# EAGLE design PoE_RFID_rev-D (EAGLE 8.7.0)

## Sheet 1 of 2
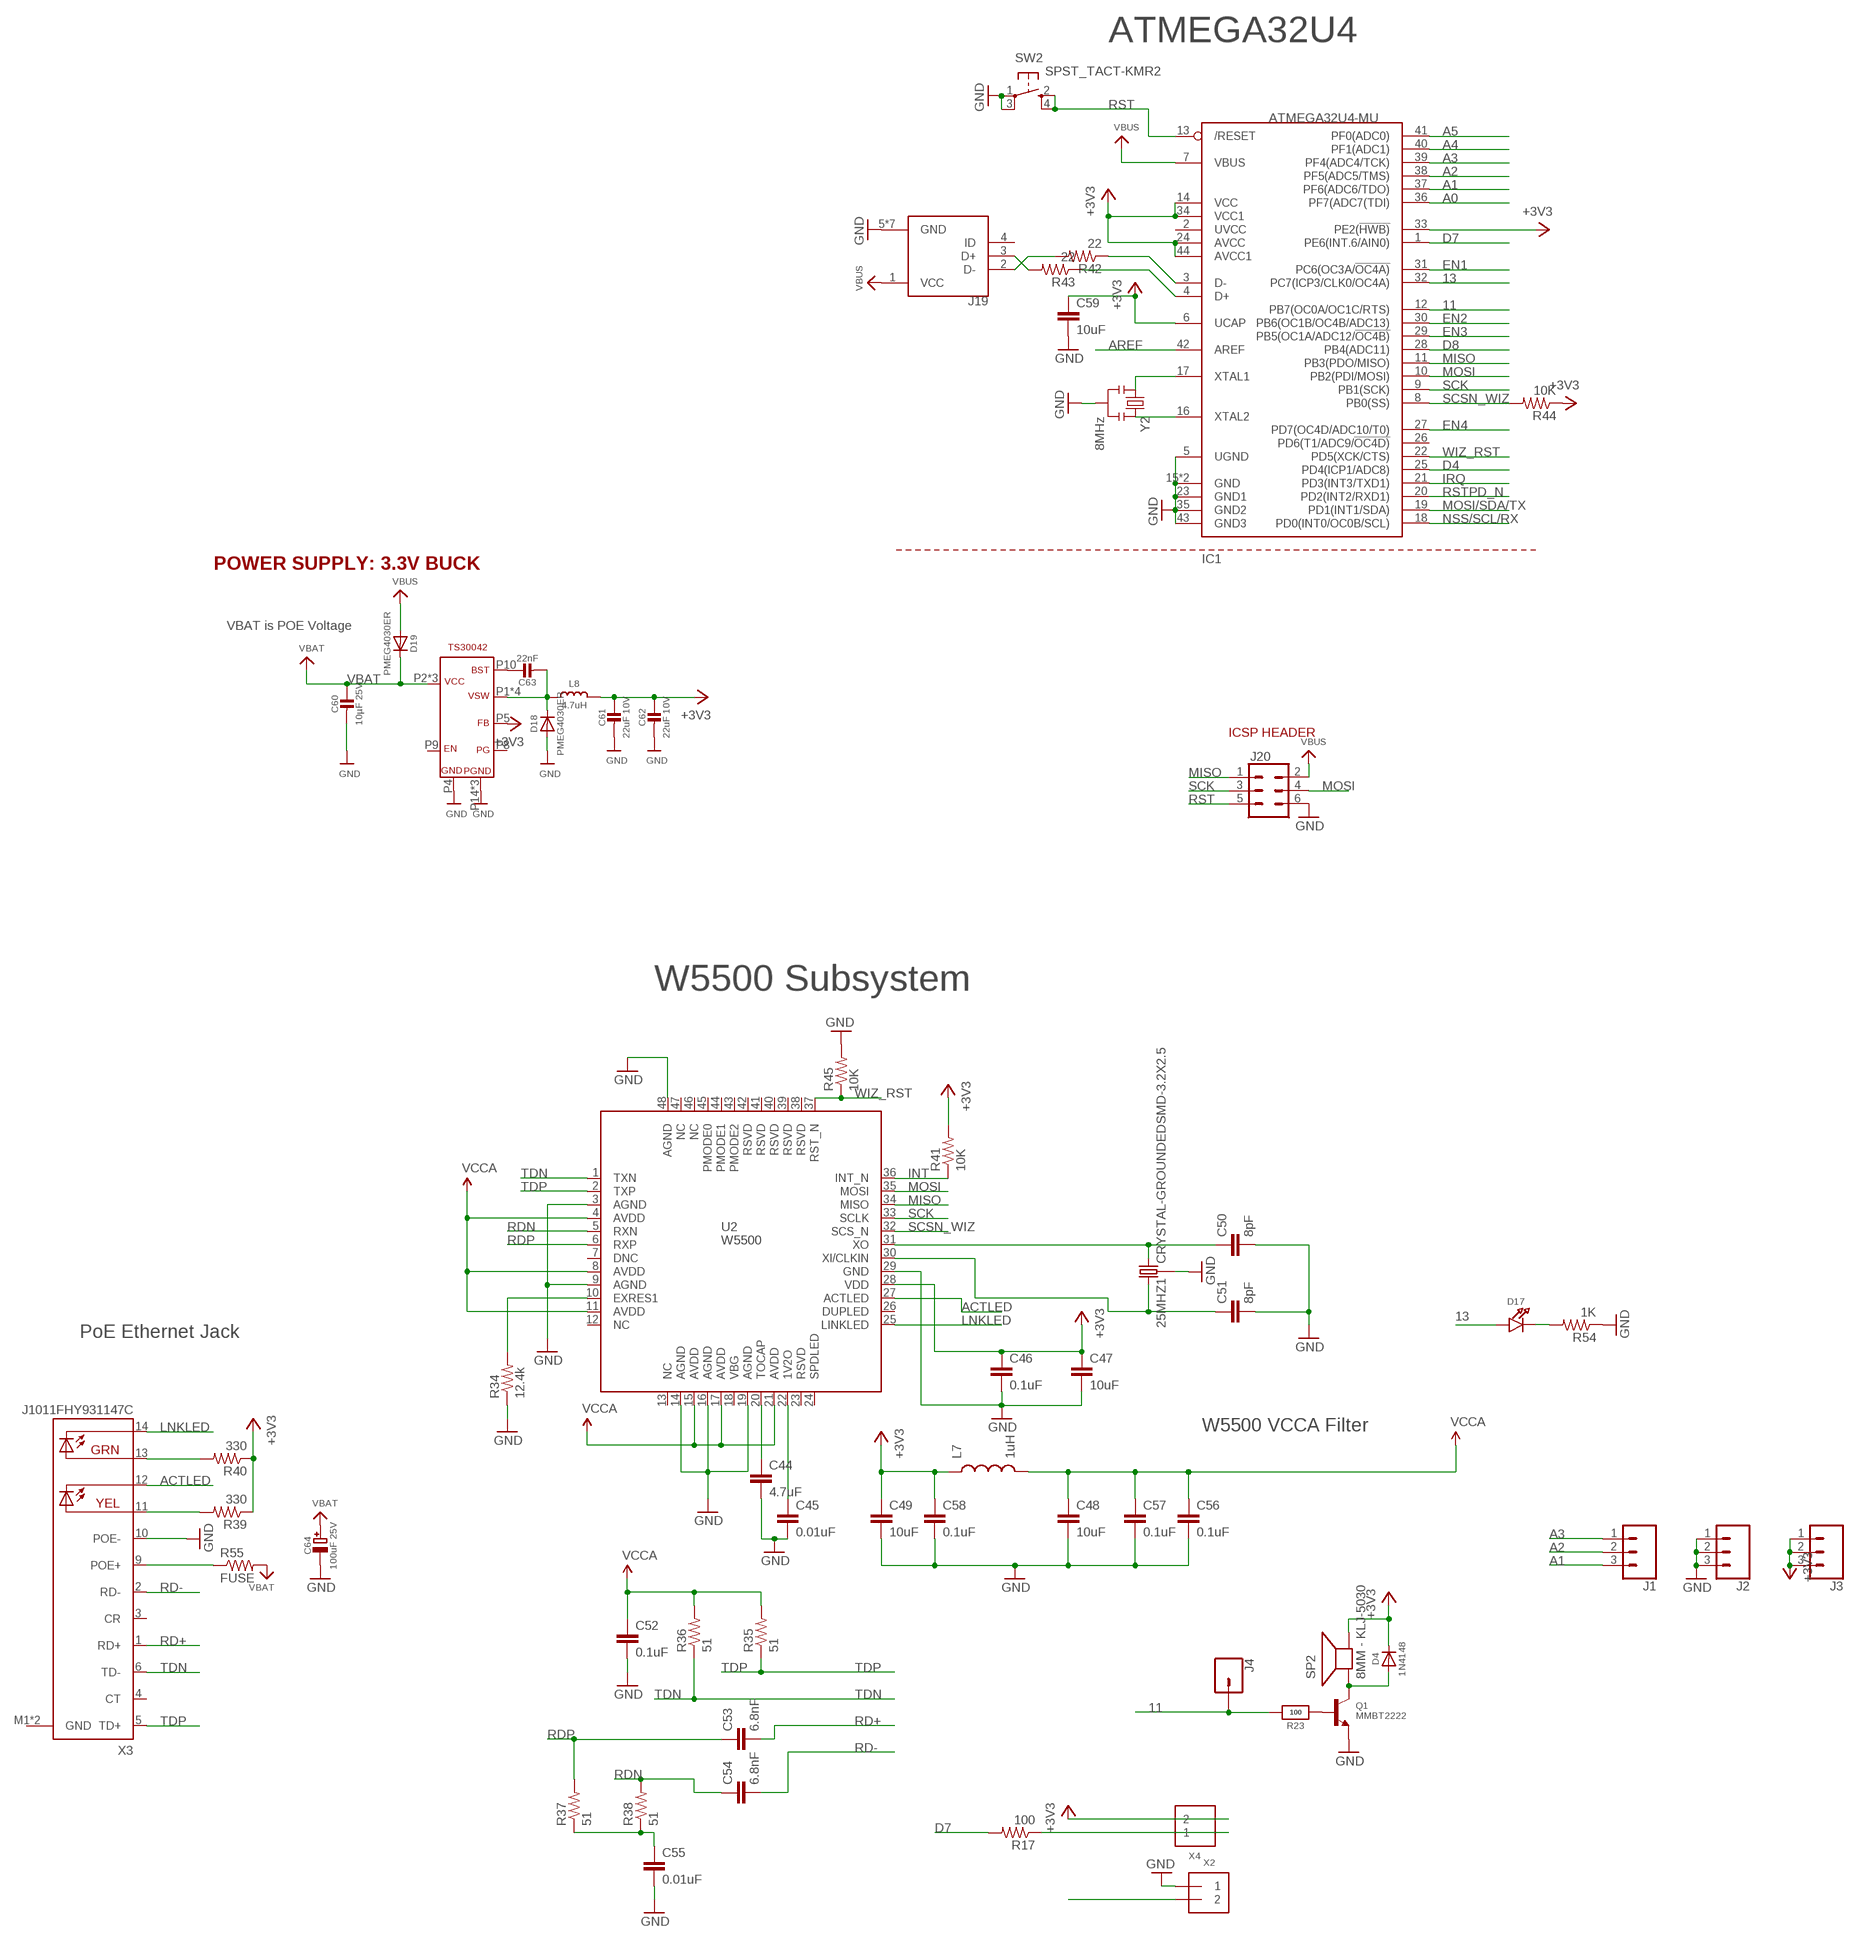
[diagram p0: schematic, sheet 1]

### Parts
25MHZ1  CRYSTAL-GROUNDEDSMD-3.2X2.5  [CRYSTAL-SMD-3.2X2.5MM]
C44  4.7uF  CAP0603-CAP  [0603-CAP]
C45  0.01uF  CAP0603-CAP  [0603-CAP]
C46  0.1uF  CAP0603-CAP  [0603-CAP]
C47  10uF  CAP0603-CAP  [0603-CAP]
C48  10uF  CAP0603-CAP  [0603-CAP]
C49  10uF  CAP0603-CAP  [0603-CAP]
C50  8pF  CAP0603-CAP  [0603-CAP]
C51  8pF  CAP0603-CAP  [0603-CAP]
C52  0.1uF  CAP0603-CAP  [0603-CAP]
C53  6.8nF  CAP0603-CAP  [0603-CAP]
C54  6.8nF  CAP0603-CAP  [0603-CAP]
C55  0.01uF  CAP0603-CAP  [0603-CAP]
C56  0.1uF  CAP0603-CAP  [0603-CAP]
C57  0.1uF  CAP0603-CAP  [0603-CAP]
C58  0.1uF  CAP0603-CAP  [0603-CAP]
C59  10uF  CAP0603-CAP  [0603-CAP]
C60  10µF 25V  CAP_CERAMIC0603MINI  [0603-MINI]
C61  22uF 10V  CAP_CERAMIC0603MINI  [0603-MINI]
C62  22uF 10V  CAP_CERAMIC0603MINI  [0603-MINI]
C63  22nF  CAP_CERAMIC0603MINI  [0603-MINI]
C64  100uF 25V  CAP_ELECTROLYTICPANASONIC_D  [PANASONIC_D]
D4  1N4148  DIODESOD-323  [SOD-323]
D17  LED0805_NOOUTLINE  [CHIPLED_0805_NOOUTLINE]
D18  PMEG4030ER  DIODESOD-123  [SOD-123]
D19  PMEG4030ER  DIODESOD-123  [SOD-123]
IC1  ATMEGA32U4-MU  [TQFN44_7MM]
J1  CONN_031X03_NO_SILK  [1X03_NO_SILK]
J2  CONN_03  [1X03]
J3  CONN_03  [1X03]
J4  CONN_01  [1X01]
J19  10103594-0001LF  [FCI_10103594-0001LF]
J20  CONN_03X2NO_SILK  [2X3-NS]
L7  1uH  INDUCTOR0603  [0603]
L8  4.7uH  INDUCTORTDK_VLC5045  [INDUCTOR_5X5MM_TDK_VLC5045]
Q1  MMBT2222  TRANSISTOR_NPNWIDE  [SOT23-WIDE]
R17  100  RESISTOR0603-RES  [0603-RES]
R23  100  RESISTOR_0603_NOOUT  [0603-NO@1]
R34  12.4k  RESISTOR0603-RES  [0603-RES]
R35  51  RESISTOR0603-RES  [0603-RES]
R36  51  RESISTOR0603-RES  [0603-RES]
R37  51  RESISTOR0603-RES  [0603-RES]
R38  51  RESISTOR0603-RES  [0603-RES]
R39  330  RESISTOR0603-RES  [0603-RES]
R40  330  RESISTOR0603-RES  [0603-RES]
R41  10K  RESISTOR0603-RES  [0603-RES]
R42  22  RESISTOR0603-RES  [0603-RES]
R43  22  RESISTOR0603-RES  [0603-RES]
R44  10K  RESISTOR0603-RES  [0603-RES]
R45  10K  RESISTOR0603-RES  [0603-RES]
R54  1K  RESISTOR0603-RES  [0603-RES]
R55  FUSE  RESISTOR0603-RES  [0603-RES]
SP2  8MM - KLJ-5030  SPEAKER_BUZZER5MM  [BUZZER_SMT_5MM]
SW2  SPST_TACT-KMR2  [KMR2]
U2  W5500  [W5500]
U$55  BUCK_CONVERTER  [QFN-16]
X2  TERMBLOCK_1X2  [TERMBLOCK_1X2-3.5MM]
X3  J1011FHY931147C  [HANRUN_POE]
X4  TERMBLOCK_1X2  [TERMBLOCK_1X2-3.5MM]
Y2  8MHz  RESONATORSMD  [RESONATOR-SMD]

### Nets
11: IC1.12(PB7(OC0A/OC1C/RTS)) J4.1 R23.2
13: D17.A IC1.32(PC7(ICP3/CLK0/OC4A))
+3V3: C46.1 C47.1 C49.1 C58.1 C59.1 C61.1 C62.1 D4.C IC1.6(UCAP) IC1.14(VCC) IC1.24(AVCC) IC1.33(PE2(!HWB)) IC1.34(VCC1) IC1.44(AVCC1) J3.1 J3.2 J3.3 L7.1 L8.P$2 R39.1 R40.1 R41.2 R44.1 SP2.- U2.28(VDD) U$55.P5(FB) X2.2 ; also sheet 2
A0: IC1.36(PF7(ADC7(TDI))
A1: IC1.37(PF6(ADC6/TDO)) J1.3
A2: IC1.38(PF5(ADC5/TMS)) J1.2
A3: IC1.39(PF4(ADC4/TCK)) J1.1
A4: IC1.40(PF1(ADC1))
A5: IC1.41(PF0(ADC0))
ACTLED: U2.27(ACTLED) X3.12(YEL-C)
AREF: IC1.42(AREF)
D4: IC1.25(PD4(ICP1/ADC8))
D7: IC1.1(PE6(INT.6/AIN0)) R17.2
D8: IC1.28(PB4(ADC11))
D+1: IC1.4(D+) R43.1
D-1: IC1.3(D-) R42.1
EN1: IC1.31(PC6(OC3A/!OC4A)) X4.2
EN2: IC1.30(PB6(OC1B/OC4B/ADC13))
EN3: IC1.29(PB5(OC1A/ADC12/!OC4B))
EN4: IC1.27(PD7(OC4D/ADC10/T0))
GND: 25MHZ1.2 25MHZ1.4 C44.2 C45.2 C46.2 C47.2 C48.2 C49.2 C50.2 C51.2 C52.2 C55.2 C56.2 C57.2 C58.2 C59.2 C60.2 C61.2 C62.2 C64.- D18.A IC1.5(UGND) IC1.15(GND) IC1.23(GND1) IC1.35(GND2) IC1.43(GND3) IC1.THERMAL(GND) J2.1 J2.2 J2.3 J19.5(GND) J19.P1(GND) J19.P2(GND) J19.P3(GND) J19.P4(GND) J19.P5(GND) J19.P6(GND) J20.6 Q1.2(E) R34.1 R45.2 R54.1 SW2.1(P) SW2.3(P1) U2.3(AGND) U2.9(AGND) U2.14(AGND) U2.16(AGND) U2.19(AGND) U2.29(GND) U2.48(AGND) U$55.P4(GND) U$55.P14(PGND) U$55.P15(PGND) U$55.PAD(PGND) X3.10(POE-) X4.1 Y2.2 ; also sheet 2
INT: R41.1 U2.36(INT_N)
IRQ: IC1.21(PD3(INT3/TXD1)) ; also sheet 2
LNKLED: U2.25(LINKLED) X3.14(GRN-C)
MISO: IC1.11(PB3(PDO/MISO)) J20.1 U2.34(MISO)
MOSI: IC1.10(PB2(PDI/MOSI)) J20.4 U2.35(MOSI)
MOSI/SDA/TX: IC1.19(PD1(INT1/SDA)) ; also sheet 2
N$15: R17.1 X2.1
N$29: Q1.1(B) R23.1
N$30: D4.A Q1.3(C) SP2.+
N$37: C44.1 U2.20(TOCAP)
N$38: C45.1 U2.22(1V2O)
N$39: R34.2 U2.10(EXRES1)
N$40: C55.1 R37.1 R38.1
N$41: 25MHZ1.3 C50.1 U2.31(XO)
N$42: 25MHZ1.1 C51.1 U2.30(XI/CLKIN)
N$43: IC1.16(XTAL2) Y2.3
N$44: IC1.17(XTAL1) Y2.1
N$45: J19.3(D+) R43.2
N$46: J19.2(D-) R42.2
N$51: D17.C R54.2
N$52: R40.2 X3.13(GRN-A)
N$53: R39.2 X3.11(YEL-A)
N$54: C63.1 U$55.P10(BST)
N$56: C63.2 D18.C L8.P$1 U$55.P1(VSW) U$55.P12(VSW) U$55.P13(VSW) U$55.P16(VSW)
N$57: R55.1 X3.9(POE+)
NSS/SCL/RX: IC1.18(PD0(INT0/OC0B/SCL)) ; also sheet 2
RD+: C53.2 X3.1(RD+)
RD-: C54.2 X3.2(RD-)
RDN: C54.1 R38.2 U2.5(RXN)
RDP: C53.1 R37.2 U2.6(RXP)
RST: IC1.13(/RESET) J20.5 SW2.2(S) SW2.4(S1)
RSTPD_N: IC1.20(PD2(INT2/RXD1)) ; also sheet 2
SCK: IC1.9(PB1(SCK)) J20.3 U2.33(SCLK)
SCSN_WIZ: IC1.8(PB0(SS)) R44.2 U2.32(SCS_N)
TDN: R36.1 U2.1(TXN) X3.6(TD-)
TDP: R35.1 U2.2(TXP) X3.5(TD+)
VBAT: C60.1 C64.+ D19.C R55.2 U$55.P2(VCC) U$55.P3(VCC) U$55.P11(VCC)
VBUS: D19.A IC1.7(VBUS) J19.1(VCC) J20.2
VCCA: C48.1 C52.1 C56.1 C57.1 L7.2 R35.2 R36.2 U2.4(AVDD) U2.8(AVDD) U2.11(AVDD) U2.15(AVDD) U2.17(AVDD) U2.21(AVDD)
WIZ_RST: IC1.22(PD5(XCK/CTS)) R45.1 U2.37(RST_N)
Unconnected: IC1.2(UVCC) IC1.26(PD6(T1/ADC9/!OC4D)) J19.4(ID) U2.7(DNC) U2.12(NC) U2.13(NC) U2.18(VBG) U2.23(RSVD) U2.24(SPDLED) U2.26(DUPLED) U2.38(RSVD) U2.39(RSVD) U2.40(RSVD) U2.41(RSVD) U2.42(RSVD) U2.43(PMODE2) U2.44(PMODE1) U2.45(PMODE0) U2.46(NC) U2.47(NC) U$55.P8(PG) U$55.P9(EN) X3.3(CR) X3.4(CT)

### Notes on the sheet
- ATMEGA32U4
- POWER SUPPLY: 3.3V BUCK
- VBAT is POE Voltage
- ICSP HEADER
- W5500 Subsystem
- PoE Ethernet Jack
- W5500 VCCA Filter

## Sheet 2 of 2
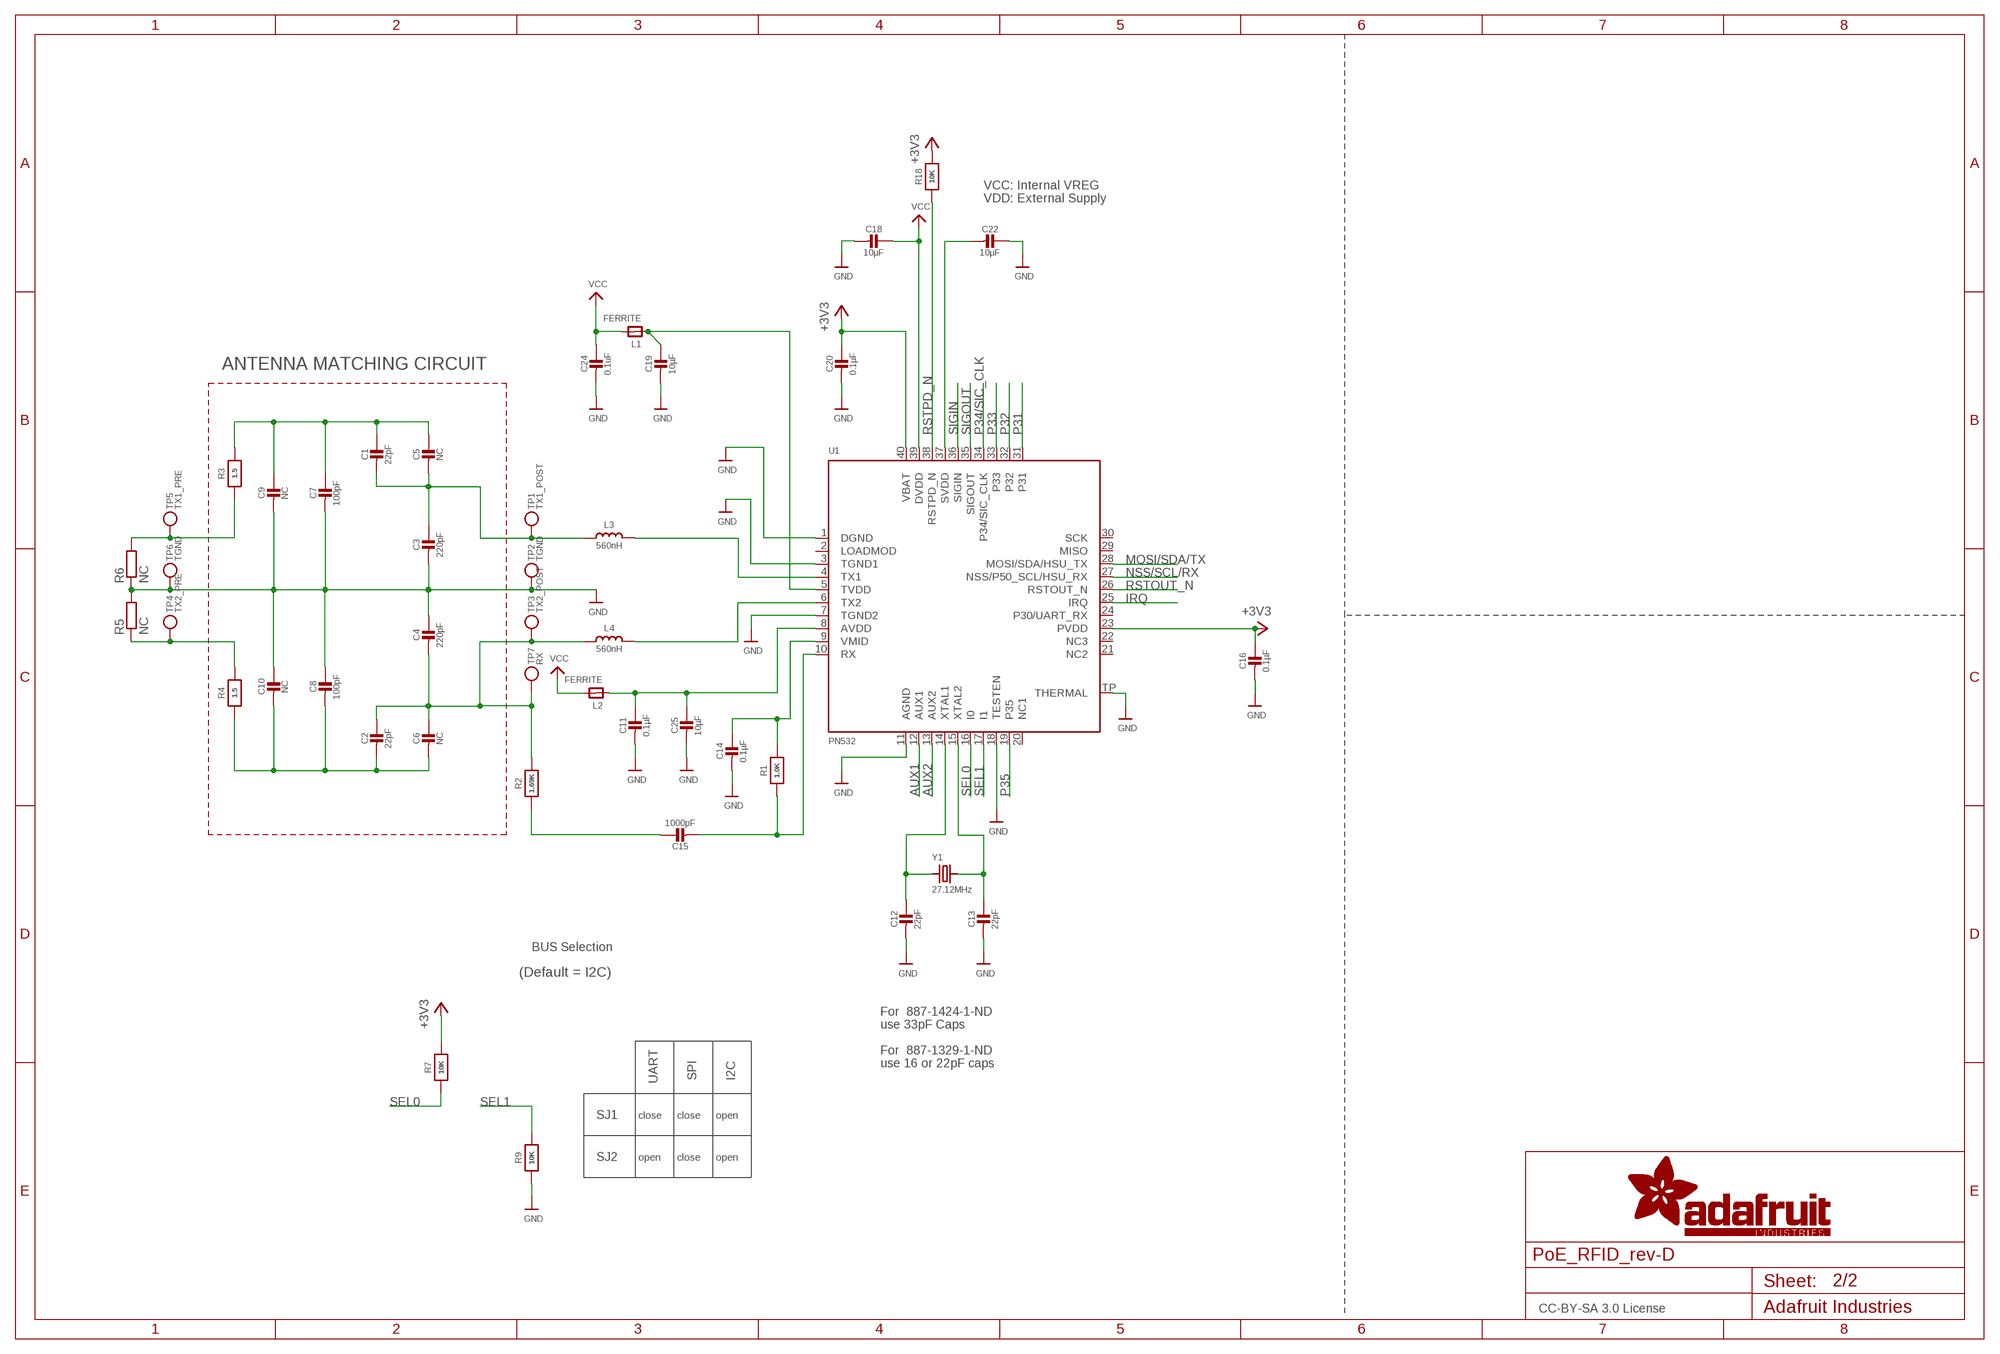
[diagram p1: schematic, sheet 2]

### Parts
C1  22pF  CAP_CERAMIC0603_NO  [0603-NO]
C2  22pF  CAP_CERAMIC0603_NO  [0603-NO]
C3  220pF  CAP_CERAMIC0603_NO  [0603-NO]
C4  220pF  CAP_CERAMIC0603_NO  [0603-NO]
C5  NC  CAP_CERAMIC0603_NO  [0603-NO]
C6  NC  CAP_CERAMIC0603_NO  [0603-NO]
C7  100pF  CAP_CERAMIC0603_NO  [0603-NO]
C8  100pF  CAP_CERAMIC0603_NO  [0603-NO]
C9  NC  CAP_CERAMIC0603_NO  [0603-NO]
C10  NC  CAP_CERAMIC0603_NO  [0603-NO]
C11  0.1µF  CAP_CERAMIC0603_NO  [0603-NO]
C12  22pF  CAP_CERAMIC0603_NO  [0603-NO]
C13  22pF  CAP_CERAMIC0603_NO  [0603-NO]
C14  0.1µF  CAP_CERAMIC0603_NO  [0603-NO]
C15  1000pF  CAP_CERAMIC0603_NO  [0603-NO]
C16  0.1µF  CAP_CERAMIC0603_NO  [0603-NO]
C18  10µF  CAP_CERAMIC0603_NO  [0603-NO]
C19  10µF  CAP_CERAMIC0603_NO  [0603-NO]
C20  0.1µF  CAP_CERAMIC0603_NO  [0603-NO]
C22  10µF  CAP_CERAMIC0603_NO  [0603-NO]
C24  0.1uF  CAP_CERAMIC0603_NO  [0603-NO]
C25  10µF  CAP_CERAMIC0603_NO  [0603-NO]
L1  FERRITE  FERRITE_0603  [_0603]
L2  FERRITE  FERRITE_0603  [_0603]
L3  560nH  INDUCTOR0603_NO  [0603-NO]
L4  560nH  INDUCTOR0603_NO  [0603-NO]
R1  1.0K  RESISTOR_0603_NOOUT  [0603-NO@1]
R2  1.69K  RESISTOR_0603_NOOUT  [0603-NO@1]
R3  1.5  RESISTOR_0603_NOOUT  [0603-NO@1]
R4  1.5  RESISTOR_0603_NOOUT  [0603-NO@1]
R5  NC  R-EU_R0201  [R0201]
R6  NC  R-EU_R0201  [R0201]
R7  10K  RESISTOR_0603_NOOUT  [0603-NO@1]
R9  10K  RESISTOR_0603_NOOUT  [0603-NO@1]
R18  10K  RESISTOR_0603_NOOUT  [0603-NO@1]
TP1  TX1_POST  TESTPOINT1.5X2.0MM_NOCREAM  [PAD-1.5X2.0]
TP2  TGND  TESTPOINT1.5X2.0MM_NOCREAM  [PAD-1.5X2.0]
TP3  TX2_POST  TESTPOINT1.5X2.0MM_NOCREAM  [PAD-1.5X2.0]
TP4  TX2_PRE  TESTPOINT1.5X2.0MM_NOCREAM  [PAD-1.5X2.0]
TP5  TX1_PRE  TESTPOINT1.5X2.0MM_NOCREAM  [PAD-1.5X2.0]
TP6  TGND  TESTPOINT1.5X2.0MM_NOCREAM  [PAD-1.5X2.0]
TP7  RX  TESTPOINT1.5X2.0MM_NOCREAM  [PAD-1.5X2.0]
U1  PN532  [HVQFN40-6X6]
Y1  27.12MHz  CRYSTAL3.2X2.5  [CRYSTAL_3.2X2.5]

### Nets
+3V3: C16.1 C20.1 R7.2 R18.2 U1.23(PVDD) U1.40(VBAT) ; also sheet 1
AUX1: U1.12(AUX1)
AUX2: U1.13(AUX2)
GND: C3.2 C4.1 C7.2 C8.1 C9.2 C10.1 C11.2 C12.2 C13.2 C14.2 C16.2 C18.2 C19.2 C20.2 C22.1 C24.2 C25.2 R5.2 R6.1 R9.1 TP2.P$1 TP6.P$1 U1.1(DGND) U1.3(TGND1) U1.7(TGND2) U1.11(AGND) U1.18(TESTEN) U1.TP(THERMAL) ; also sheet 1
IRQ: U1.25(IRQ) ; also sheet 1
MOSI/SDA/TX: U1.28(MOSI/SDA/HSU_TX) ; also sheet 1
N$1: L3.2 U1.4(TX1)
N$2: L4.2 U1.6(TX2)
N$3: C1.2 C3.1 C5.2 L3.1 TP1.P$1
N$4: R3.1 R6.2 TP5.P$1
N$5: R4.2 R5.1 TP4.P$1
N$7: C12.1 U1.14(XTAL1) Y1.1
N$8: C13.1 U1.15(XTAL2) Y1.2
N$9: C15.1 R2.1
N$10: C14.1 R1.2 U1.9(VMID)
N$11: C15.2 R1.1 U1.10(RX)
N$12: C2.1 C4.2 C6.1 L4.1 R2.2 TP3.P$1 TP7.P$1
N$13: C11.1 C25.1 L2.1 U1.8(AVDD)
N$14: C19.1 L1.1 U1.5(TVDD)
N$55: C22.2 U1.37(SVDD)
NSS/SCL/RX: U1.27(NSS/P50_SCL/HSU_RX) ; also sheet 1
P31: U1.31
P32: U1.32
P33: U1.33
P34/SIC_CLK: U1.34(P34/SIC_CLK)
P35: U1.19(P35)
RSTOUT_N: U1.26(RSTOUT_N)
RSTPD_N: R18.1 U1.38(RSTPD_N) ; also sheet 1
SEL0: R7.1 U1.16(I0)
SEL1: R9.2 U1.17(I1)
SIGIN: U1.36(SIGIN)
SIGOUT: U1.35(SIGOUT)
TX1_ANTENNA: C1.1 C5.1 C7.1 C9.1 R3.2
TX2_ANTENNA: C2.2 C6.2 C8.2 C10.2 R4.1
VCC: C18.1 C24.1 L1.2 L2.2 U1.39(DVDD)
Unconnected: U1.2(LOADMOD) U1.20(NC1) U1.21(NC2) U1.22(NC3) U1.24(P30/UART_RX) U1.29(MISO) U1.30(SCK)

### Notes on the sheet
- VCC: Internal VREG
- VDD: External Supply
- ANTENNA MATCHING CIRCUIT
- BUS Selection
- (Default = I2C)
- For  887-1424-1-ND
- use 33pF Caps
- For  887-1329-1-ND
- use 16 or 22pF caps
- UART | SPI | I2C
- SJ1 | close | close | open
- SJ2 | open | close | open
- CC-BY-SA 3.0 License

## Power pins joined to a net without a drawn wire
GND: X3.M1(GND) X3.M2(GND)

## Library data of the parts
25MHZ1 = SparkFun-Clocks:CRYSTAL-GROUNDED: Crystals w/ Ground Pin (Generic) These are passive quartz crystals, which can be used as a clock source for a microcontroller. Crystal's are usually two-terminal devices. A third terminal may be optionally connected to ground, as recommended by the manufaturer.
C1-C16 C18-C20 C22 C24 C25 C60-C63 = microbuilder:CAP_CERAMIC: Ceramic Capacitors For new designs, use the packages preceded by an '_' character since they are more reliable: The following footprints should be used on most boards: _0402 - Standard footprint for regular board layouts _0603 - Standard footprint for regular board layouts _0805 - Standard footprint for regular board layouts _1206 - Standard footprint for regular board layouts For extremely tight-pitch boards where space is at a premium, the following 'micro-pitch' footprints can be used (smaller pads, no silkscreen outline, etc.): _0402MP - Micro-pitch footprint for very dense/compact boards _0603MP - Micro-pitch footprint for very dense/compact boards _0805MP - Micro-pitch footprint for very dense/compact boards _1206MP - Micro-pitch footprint for very dense/compact boards
C44-C59 = SparkFun-Passives:CAP: Capacitor Standard 0603 ceramic capacitor, and 0.1" leaded capacitor.
C64 = microbuilder:CAP_ELECTROLYTIC: Electrolytic Capacitors SMT PANASONIC_C - Size C Panasonic Electrolytic Aluminum Capacitor 47µF 16V 20% Electrolytic Capacitor [Digikey: PCE3890TR-ND] PANASONIC_D - Size D Panasonic Electrolytic Aluminum Capacitor 100µF 25V 20% Electrolytic Capacitor [Digikey: PCE3898TR-ND] PTH 3.5 mm grid, 8 mm diameter ... 3.5 mm grid, 10 mm diameter ...
D4 D18 D19 = microbuilder:DIODE: Diode SMA Model Volts Amps Type Vf Ir Digikey # Notes SSA34-E3 40V 3A Schottky 480mV @ 3A 200uA @ 40V SSA34-E3/61TGITR-ND CDBA120-G 20V 1A Schottky 500mV @ 1A 500uA @ 20V 641-1014-6-ND REEL MBRA210 10V 2A Schottky 350mV @ 2A 700uA @ 10V MBRA210LT3 SOD-123 Model Volts Amps Type Vf Ir Order # Notes BAT54T1G 30V 200mA Schottky 800mV @ 200mA 2uA @ 25V BAT54T1GOSTR-ND B0530W 30V 500mA Schottky 430mV @ 500mA 130uA @ 30V B0530W-FDICT-ND REEL MBR120 20V 1A Schottky 340mV @ 1A MBR120VLSFT1GOSCT-ND SOD-323 Model Volts Amps Type Vf Ir Order # Notes PMEG2005EJ 20V 500mA Schottky 355mV @ 500mA 568-4110-1-ND ZLLS410 10V 570mA Schottky 380mV @ 570mA ZLLS410CT-ND 1N4148WS 75V 150mA Silicon/Simple 1V 1N4148WSFSCT-ND REEL SOD-523 Model Volts Amps Type Vf Ir Order # Notes BAT54XV2 30V 200mA Schottky 0.8V @ 100mA BAT54XV2CT-ND TB751S 30V 30mA Schottky RB751S-40TE61CT-ND SOT23-R/W (R = Solder Paste/Reflow Ovens, W = Hand-Soldering) Model Volts Amps Type Vf Ir Order # Notes BAT54FILM 40V 300mA Schottky 497-7162-1-ND POWERDI-5 Model Volts Amps Type Vf Ir Order # Notes PDS560 60V 5A Schottky 670mV @ 5A 150uA @ 60V PDS560DICT-ND
D17 = microbuilder:LED: LED 0603 - 0603 Surface Mount Package 2mA: Green LED - Low Power (3.9mcd, 2ma, 1.7Vf) - Digikey: 475-2709-2-ND Orange LED - Low Power (9.8mcd, 2ma, 1.8Vf) - Digikey: 475-1194-2-ND Red LED - Low Power (5mcd, 2ma, 1.8Vf) - Digikey: 475-1195-2-ND Yellow LED - Low Power (7mcd, 2ma, 1.8Vf) - Digikey: 475-1196-2-ND 5mA: Blue LED - Low Power (17mcd, 5ma, 2.9Vf) - Digikey: LNJ937W8CRACT-ND 0805 - 0805 Surface Mount Package 2mA: Red LED (8.8mcd, 2mA, 1.8Vf, Clear) - Low Power [Digikey: 475-2510-1-ND] Green LED (5mcd, 2mA, 1.8Vf, Clear) - Low Power [Digikey: 475-2730-1-ND] Yellow LED (11.3mcd, 2mA, 1.8Vf, Clear) - Low Power [Digikey: 475-2555-1-ND] 20mA: Red LED (104mcd, 20mA, Diffused) - LS R976 [Digikey: 475-1278-6-ND] Red LED (12mcd, 20mA, 2.0Vf, Clear) - APT2012EC [Digikey: 754-1128-1-ND] Green LED (15mcd, 20mA, 2.2Vf, Clear) - APT2012GC [Digikey: 754-1131-1-ND] Orange LED (160mcd, 20mA, 2.1Vf, Clear) - APT2012SECK [Digikey: 754-1130-1-ND] 1206 - 1206 Surface Mount Package Green LED (26mcd, 20mA, Diffused) - LG N971 [Digikey: 475-1407-6-ND] Red LED (15mcd, 20mA, Diffused) - LH N974 [Digikey: 475-1416-6-ND] Cree - Cree High-Power Surface Mount LEDs XPEBWT-L1-0000-00D50 - White 111lm 350mA 2.9Vf 6200K 110° XTEAWT-00-0000-00000LEE3 - White 114lm 350mA 2.85Vf 5000K 115° Everlight - Everlight 45-21 Series Surface Mount LEDs 45-21/QK2C-B2832AC2CB2/2T - Warm White 2000mcd 20mA 3.25Vf 3050K 120° 45-21/LK2C-B38452C4CB2/2T - Nuetral White 2000mcd 20mA 3.25Vf 4150K 120° 45-21/LK2C-B50634C6CB2/2T - Cold White 2200mcd 20mA 3.25Vf 5650K 120° PLCC2 Reverse Mount LS T77K-J1L2-1-0-2-R18-Z - Red 11.25mcd 2mA 1.8Vf 630nm 120° LO T77K-L1M2-24-Z - Orange 19.6mcd 2mA 1.8Vf 606nm 120° LY T77K-K2M1-26-Z - Yellow 15.7mcd 2mA 1.8Vf 587nm 120°
IC1 = microbuilder:ATMEGA32U4: http://www.ladyada.net/library/eagle
J1-J3 = SparkFun-Connectors:CONN_03: Multi connection point. Often used as Generic Header-pin footprint for 0.1 inch spaced/style header connections On any of the 0.1 inch spaced packages, you can populate with these: Break Away Headers - Straight <https://www.sparkfun.com/products/116> (PRT-00116) Break Away Male Headers - Right Angle <https://www.sparkfun.com/products/553> (PRT-00553) Female Headers <https://www.sparkfun.com/products/115> (PRT-00115) Break Away Headers - Machine Pin <https://www.sparkfun.com/products/117> (PRT-00117) Break Away Female Headers - Swiss Machine Pin <https://www.sparkfun.com/products/743> (PRT-00743) Stackable Header - 3 Pin (Female, 0.1") <https://www.sparkfun.com/products/13875> (PRT-13875) For SCREWTERMINALS and SPRING TERMINALS visit here: Screw Terimnals on SparkFun.com <https://www.sparkfun.com/search/results?term=Screw+Terminals> (5mm/3.5mm/2.54mm spacing) This device is also useful as a general connection point to wire up your design to another part of your project. Our various solder wires solder well into these plated through hole pads. Hook-Up Wire - Assortment (Stranded, 22 AWG) <https://www.sparkfun.com/products/11375> (PRT-11375) Hook-Up Wire - Assortment (Solid Core, 22 AWG) <https://www.sparkfun.com/products/11367> (PRT-11367) View the entire wire category on our website here <https://www.sparkfun.com/categories/141> Special notes: Molex polarized connector foot print use with SKU : PRT-08232 with associated crimp pins and housings.
J4 = SparkFun-Connectors:CONN_01: Single connection point. Often used as Generic Header-pin footprint for 0.1 inch spaced/style header connections On any of the 0.1 inch spaced packages, you can populate with these: Break Away Headers - Straight <https://www.sparkfun.com/products/116> (PRT-00116) Break Away Male Headers - Right Angle <https://www.sparkfun.com/products/553> (PRT-00553) Female Headers <https://www.sparkfun.com/products/115> (PRT-00115) Break Away Headers - Machine Pin <https://www.sparkfun.com/products/117> (PRT-00117) Break Away Female Headers - Swiss Machine Pin <https://www.sparkfun.com/products/743> (PRT-00743) This device is also useful as a general connection point to wire up your design to another part of your project. Our various solder wires solder well into these plated through hole pads. Hook-Up Wire - Assortment (Stranded, 22 AWG) <https://www.sparkfun.com/products/11375> (PRT-11375) Hook-Up Wire - Assortment (Solid Core, 22 AWG) <https://www.sparkfun.com/products/11367> (PRT-11367) View the entire wire category on our website here <https://www.sparkfun.com/categories/141> Special notes: SMTSO-256-ET is a "flush mount" nut for a 4-40 screw. We mostly use this on specialty testbeds; it is a nice way to connect hardware to your PCB at an adjustable hieght. Also note, the SNAP packages are for using a snappable style connector. We sell a baggie of snaps and they are also used on two LilyPad designs: Snap Assortment - 30 pack (male and female) <https://www.sparkfun.com/products/11347> (DEV-11347) LilyPad Arduino SimpleSnap <https://www.sparkfun.com/products/10941> (DEV-10941) LilyPad SimpleSnap Protoboard <https://www.sparkfun.com/products/10940> (DEV-10940)
J19 = 10103594-0001LF:10103594-0001LF: Conn Micro USB Type B RCP 5 POS 0.65mm Solder RA SMD 5 Terminal 1 Port T/R; AVAILABILITY: Good; DESCRIPTION: Conn Micro USB Type B RCP 5 POS 0.65mm Solder RA SMD 5 Terminal 1 Port T/R; MF: FCI; MP: 10103594-0001LF; PACKAGE: None; PRICE: 0.40 USD
J20 = SparkFun-Connectors:CONN_03X2: Multi connection point. Often used as Generic Header-pin footprint for 0.1 inch spaced/style header connections You can populate with any combo of single row headers, but if you'd like an exact match, check these: Header - 2x3 (Male, 0.1") <https://www.sparkfun.com/products/12807> (PRT-12807) Header - 2x3 (Female, 0.1") <https://www.sparkfun.com/products/13010> (PRT-13010) 2x3 Pin Shrouded Header <https://www.sparkfun.com/products/10877> (PRT-10877) On any of the 0.1 inch spaced packages, you can populate with these: Break Away Headers - Straight <https://www.sparkfun.com/products/116> (PRT-00116) Break Away Male Headers - Right Angle <https://www.sparkfun.com/products/553> (PRT-00553) Female Headers <https://www.sparkfun.com/products/115> (PRT-00115) Break Away Headers - Machine Pin <https://www.sparkfun.com/products/117> (PRT-00117) Break Away Female Headers - Swiss Machine Pin <https://www.sparkfun.com/products/743> (PRT-00743) Special note: the shrouded connector mates well with our 3x2 ribbon cables: Ribbon Crimp Connector - 6-pin (2x3, Female) <https://www.sparkfun.com/products/10651> (PRT-10651) Ribbon Cable - 6 wire (15ft) <https://www.sparkfun.com/products/10646> (PRT-10646)
L1 L2 = microbuilder:FERRITE: Ferrite Bead 0603 MMZ1608B121C - 120 Ohm @ 100MHz, 600mA, 0.15 Ohm DC Resistance - Digikey: 445-2164-1-ND BK1608HW121-T - 120 Ohm, 600mA Ferrite Chip - Digikey: 587-1876-2-ND 0805 HZ0805B272R-10 - 2.7K Ohm @ 100MHz, 200mA, 0.8 Ohm DC Resistance - Digikey: 240-2504-1-ND (see also Murata BLM21BD272SN1L) MMZ2012Y152B - 1.5K Ohm @ 100MHz, 500mA, 0.4 Ohm DC Resistance - Digikey: 445-1560-1-ND - Mainly for high frequency (80-400MHz) MMZ2012R102A - 1K Ohm @ 100MHz, 500mA, 0.3 Ohm DC Resistance - Digikey: 445-1555-2-ND - More general purpose (10-200MHz)
L3 L4 L8 = microbuilder:INDUCTOR: Inductors
L7 = SparkFun-Passives:INDUCTOR: Inductors
Q1 = microbuilder:TRANSISTOR_NPN: NPN Transistor Transistor (NPN) 500mA 45V - BC817 [Digikey: 568-1631-1-ND] Transistor (NPN) 500mA 45V - BC817,215 [Mouser: 771-BC817-T/R] SOT23-R - SOT23 footprint optimised for use with solder paste and reflow ovens. SOT23-W - SOT23 footprint optimised for hand-soldering (larger pads).
R1-R4 R7 R9 R18 R23 = microbuilder:RESISTOR: Resistors For new designs, use the packages preceded by an '_' character since they are more reliable: The following footprints should be used on most boards: _0402 - Standard footprint for regular board layouts _0603 - Standard footprint for regular board layouts _0805 - Standard footprint for regular board layouts _1206 - Standard footprint for regular board layouts For extremely tight-pitch boards where space is at a premium, the following 'micro-pitch' footprints can be used (smaller pads, no silkscreen outline, etc.): _0402MP - Micro-pitch footprint for very dense/compact boards _0603MP - Micro-pitch footprint for very dense/compact boards _0805MP - Micro-pitch footprint for very dense/compact boards _1206MP - Micro-pitch footprint for very dense/compact boards
R5 R6 = rcl:R-EU_: RESISTOR, European symbol
R17 R34-R45 R54 R55 = SparkFun-Passives:RESISTOR: Resistor Basic schematic elements and footprints for 0603, 1206, and PTH resistors.
SP2 = microbuilder:SPEAKER: SPEAKER Source: Buerklin Added PS12 (for part # PS1240 piezo) http://www.ladyada.net/library/pcb/eaglelibrary.html
SW2 = adafruit:SPST_TACT: SMT 6mm switch, EVQQ2 series http://www.ladyada.net/library/eagle
TP1-TP7 = microbuilder:TESTPOINT: Test Point Various test points for characterisation and PCB testing TESTPOINT_SMT - Compact Surface Mount Test Point [Digikey: 5016KTR-ND]
U1 = microbuilder:PN532: PN532 - Near Field Communication (NFC) controller Highly integrated transceiver module for contactless communication at 13.56 MHz (14443A/MIFARE, FeliCa, I4443B)
U2 = W5500:W5500
U$55 = Heep:BUCK_CONVERTER
X2 X4 = microbuilder:TERMBLOCK_1X2: 3.5mm Terminal block http://www.ladyada.net/library/pcb/eaglelibrary.html
X3 = Heep:J1011F: PULSEJACK (TM) 1x1 Tab-UP RJ45 10/100 Base-TX RJ45 1x1 Tab-UP with LEDs 8-pin (J1 series) and 6-pin (JP series) integrated magnetics connector, designed to support applications, such as ADSL modems, LAN-on-Motherboard, and Hub and Switches. Source: www.pulseeng.com .. PulseJack-J402.pdf
Y1 = microbuilder:CRYSTAL: Crystals HC49UP - Surface Mount Crystal 4.0MHz 18pF +/-30ppm Surface Mount Crystal [Digikey: 535-9857-1-ND] 12.0 MHz Surface Mount Crystal [Digikey: 535-9869-6-ND] 25.0 MHz Surface Mount Crystal [Digikey: 535-9078-1-ND] 2.5 x 2.0mm - MEMs SMT Crystal 16.0 MHz 10pF 20ppm 2.5 x 2.0mm Crystal [Digikey -40-85°C: 535-10923-1-ND] 3.2 x 2.5mm - MEMs SMT Crystal 12.0 MHz 8pF 15ppm 3.2 x 2.5mm Crystal [Digikey: -10-70°C: 644-1047-1-ND -40-125°C: 644-1128-1-ND] 40~85°C cheaper: 644-1173-6-ND 16.0 MHz 8pF 15ppm 3.2 x 2.5mm Crystal [Digikey: -10-70°C: 644-1049-1-ND -40-125°C: 644-1129-2-ND]-40~85°C cheaper: 644-1175-6-ND 16.0 MHz 10pF 10ppm 3.2 x 2.5mm Crystal [Digikey: 644-1100-1-ND] 27.12 MHz 18pF 30ppm 3.2 x 2.5mm Crystal [Digikey: 887-1424-1-ND] 27.12MHz 10pF 10ppm 3.2 x 2.5mm Crystal [Digikey: 887-1329-1-ND] 4.9 x 1.8mm - MEMs SMT Crystal 32.768 KHz 12.5pF 20ppm 4.9 x 1.8mm Crystal [Digikey: SE2415CT-ND] 8.0 x 3.8mm - Surface Mount Crystal 32.768kHz 12.5pF 20ppm -40°C-85°C [Digikey: 535-9166-2-ND] Cylinder 32.768KHz Cylinder Crystal (2x6mm body) [Ex. Digikey: 300-8341-2-ND]
Y2 = SparkFun:RESONATOR: Resonator Small SMD resonator. This is the itty bitty 10/20MHz resonators with built in caps. CSTCE10M0G55 and CSTCE20M0V53. Footprint has been reviewed closely but hasn't been tested yet.

## Net classes
3 usbvcc: width 0.305 mm, drill 0.483 mm, clearance 0.203 mm

## Board
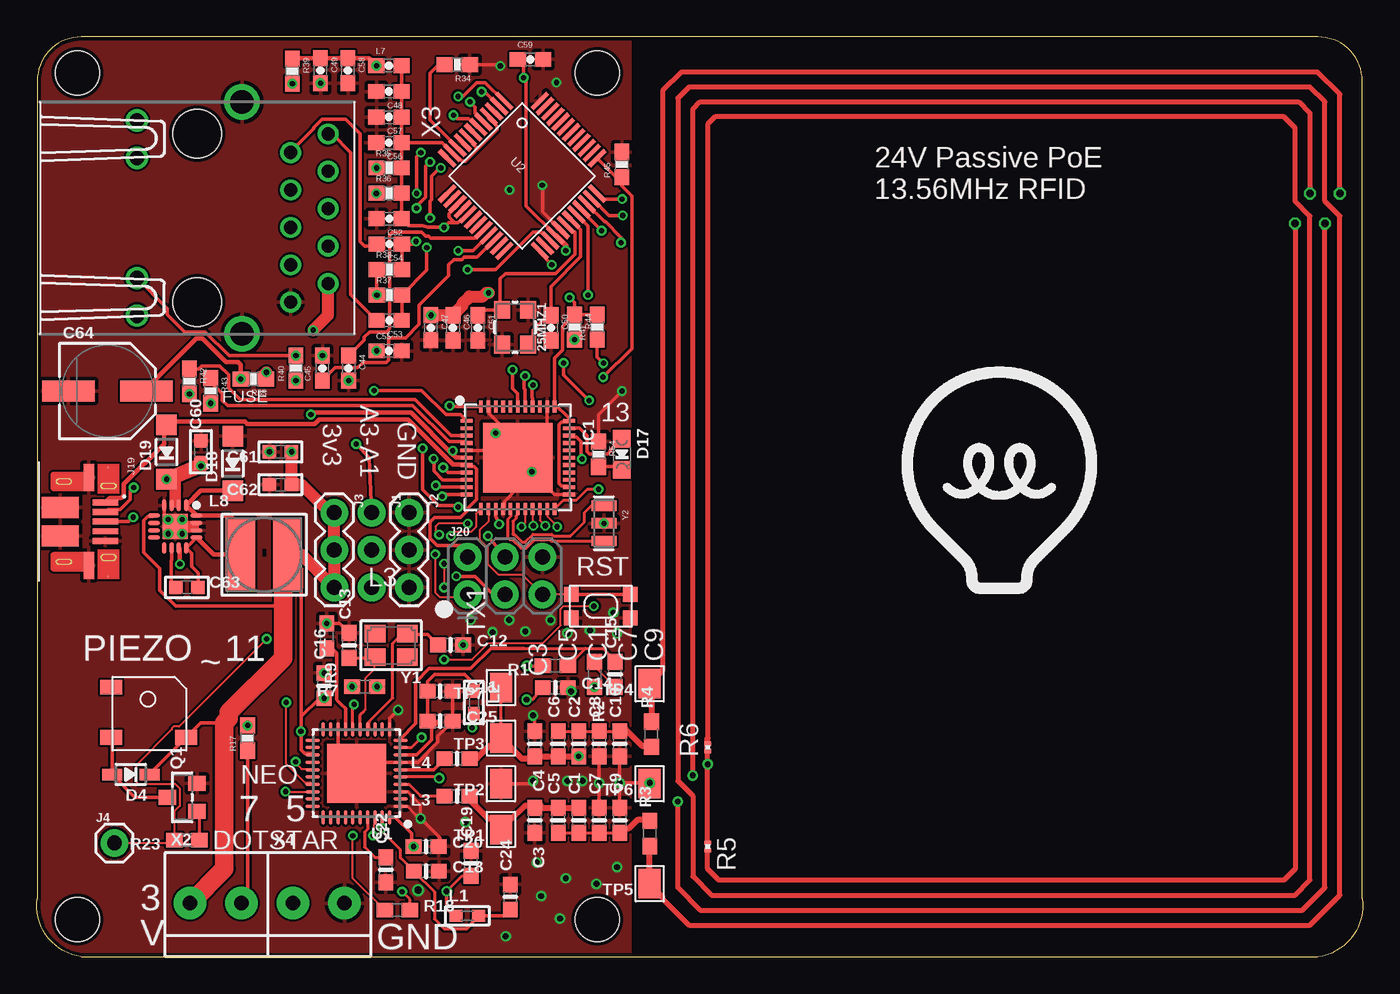
[diagram p2: board, top side]
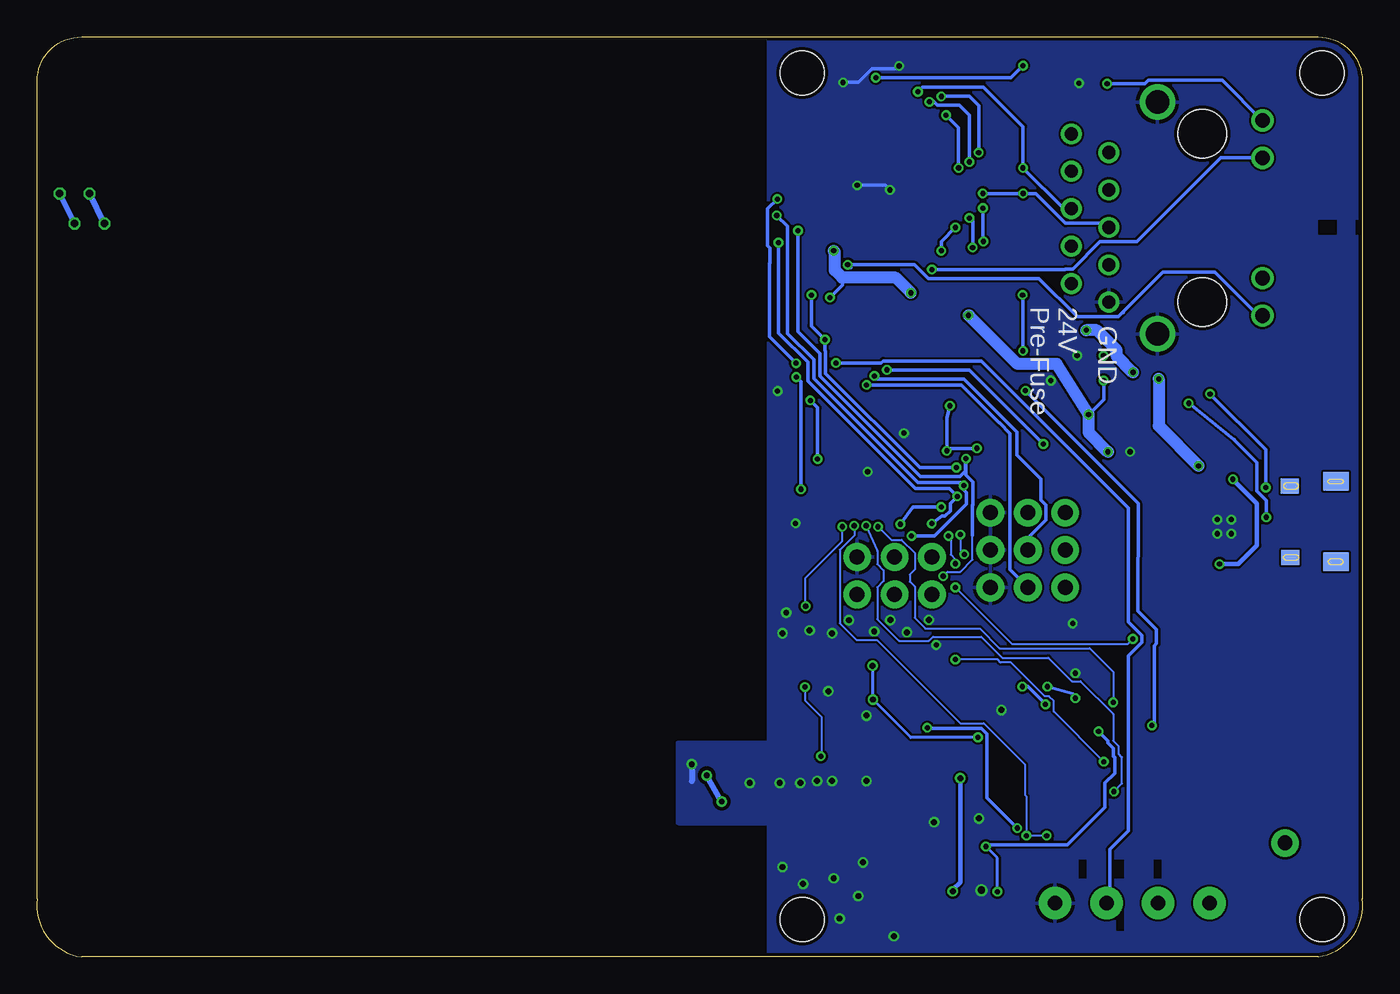
[diagram p3: board, bottom side, seen from below]

Size 90.01 x 62.47 mm. Coordinates in mm from the lower left corner, seen from the top.
Outline: 3.03,0 86.96,0 arc90 89.98,3.95 89.98,59.47 arc90 86.96,62.47 3.03,62.47 arc90 0.03,59.47 0.03,3.95 arc90 3.03,0
Copper layers (1*16): Top 0.035mm / dielectric 1.5mm / Bottom 0.035mm
Design rules "SeeedStudio_2layer_DRU_no_angle_20140221": minimum track width 6mil, minimum drill 12mil, track to track 6mil, track to pad 6mil, pad to pad 6mil, via to via 6mil, smd to smd 0mil, copper to edge 10mil, drill to drill 10mil, minimum pad ring 10mil, minimum via ring 6mil, stop-mask expansion 2mil, vias tented up to drill 100mil, thermal gap 10mil
Holes 3 mm at 38.05,60.01 38.05,2.54 2.76,60.01 2.76,2.54
tRestrict: area 20.3,24.9 to 20.9,25; area 19.6,27.2 to 19.9,27.7; area 17.3,25.1 to 17.9,25.4; area 15.3,27.2 to 15.6,27.7; area 17.1,29.5 to 18.1,29.7; area 20.3,96.3 to 20.9,96.4; area 19.6,98.6 to 19.9,99.1; area 17.3,96.5 to 17.9,96.8; area 15.3,98.6 to 15.6,99.1; area 17.1,100.8 to 18.1,101.1
bRestrict: area -0.8,49 to 0.5,50; area 1.7,49 to 3,50; area 16.2,1.8 to 16.7,3; area 16.2,5.3 to 16.7,6.6; area 13.7,5.3 to 14.2,6.6; area 18.8,5.3 to 19.3,6.6

### Footprints (pad centres in the part's own frame; a part is rotated, then mirrored left to right if it is on the bottom)
CRYSTAL-SMD-3.2X2.5MM = smd 1.2 x 1.1: 1 -1.175,-0.875; 2 1.175,-0.875; 3 1.175,0.875; 4 -1.175,0.875
0603-NO = smd 1.075 x 1: 1 -0.85,0; 2 0.85,0
0603-CAP = smd 1.1 x 1: 1 -0.85,0; 2 0.85,0
0603-MINI = smd 0.9 x 0.9: 1 -0.75,0; 2 0.75,0
PANASONIC_D = smd 3.556 x 1.4: + 2.654,0; - -2.654,0
SOD-323 = smd 1.35 x 0.8: A 1.27,0; C -1.27,0
CHIPLED_0805_NOOUTLINE = smd 1.2 x 1.2: A 0,-1.05; C 0,1.05
SOD-123 = smd 1.4 x 1.4: A 1.85,0; C -1.85,0
TQFN44_7MM = smd 0.25 x 0.8: 1 -2.5,-3.475; 2 -2,-3.475; 3 -1.5,-3.475; 4 -1,-3.475; 5 -0.5,-3.475; 6 0,-3.475; 7 0.5,-3.475; 8 1,-3.475; 9 1.5,-3.475; 10 2,-3.475; 11 2.5,-3.475; 23 2.5,3.475; 24 2,3.475; 25 1.5,3.475; 26 1,3.475; 27 0.5,3.475; 28 0,3.475; 29 -0.5,3.475; 30 -1,3.475; 31 -1.5,3.475; 32 -2,3.475; 33 -2.5,3.475 | smd 0.8 x 0.25: 12 3.475,-2.5; 13 3.475,-2; 14 3.475,-1.5; 15 3.475,-1; 16 3.475,-0.5; 17 3.475,0; 18 3.475,0.5; 19 3.475,1; 20 3.475,1.5; 21 3.475,2; 22 3.475,2.5; 34 -3.475,2.5; 35 -3.475,2; 36 -3.475,1.5; 37 -3.475,1; 38 -3.475,0.5; 39 -3.475,0; 40 -3.475,-0.5; 41 -3.475,-1; 42 -3.475,-1.5; 43 -3.475,-2; 44 -3.475,-2.5 | smd 4.7 x 4.7: THERMAL 0,0
1X03_NO_SILK = drill 1.016 pad 1.88: 1 0,0; 2 2.54,0; 3 5.08,0
1X03 = drill 1.016 pad 1.88: 1 0,0; 2 2.54,0; 3 5.08,0
1X01 = drill 1.016 pad 1.88: 1 0,0
FCI_10103594-0001LF = smd 0.4 x 1.75: 1 -1.3,2.825; 2 -0.65,2.825; 3 0,2.825; 4 0.65,2.825; 5 1.3,2.825 | smd 0.1 x 0.1: P1 -3.7,3; P2 3.7,3 | smd 1.825 x 0.7: P3 -2.987,1.7; P4 2.987,1.7 | smd 1.425 x 2.5: P5 -0.963,-0.25; P6 0.963,-0.25 | smd 1.25 x 1.75 bottom: P$1 -2.731,-0.026; P$2 2.726,-0.018 | smd 1 x 1.25 bottom: P$3 -2.422,3.111; P$4 2.427,3.078
2X3-NS = drill 1.016 pad 1.88: 1 -2.54,-1.27; 2 -2.54,1.27; 3 0,-1.27; 4 0,1.27; 5 2.54,-1.27; 6 2.54,1.27
_0603 = smd 0.9 x 0.8: 1 -0.762,0; 2 0.762,0
0603 = smd 1.1 x 1: 1 -0.85,0; 2 0.85,0
INDUCTOR_5X5MM_TDK_VLC5045 = smd 2 x 5: P$1 -1.6,0; P$2 1.6,0
SOT23-WIDE = smd 1 x 1.2: 1 -0.95,-1; 2 0.95,-1; 3 0,1
0603-NO@1 = smd 1.1 x 1: 1 -0.85,0; 2 0.85,0
R0201 = smd 0.28 x 0.43: 1 -0.255,0; 2 0.255,0
0603-RES = smd 1.1 x 1: 1 -0.85,0; 2 0.85,0
BUZZER_SMT_5MM = smd 1.5 x 1: + -2.6,-1.6; - 2.5,-1.6; MT -2.6,1.8
KMR2 = smd 1 x 1: 1 2,0.8; 2 2,-0.8; 3 -2,0.8; 4 -2,-0.8
PAD-1.5X2.0 = smd 1.5 x 2: P$1 0,0
HVQFN40-6X6 = smd 1 x 0.25: 1 -2.99,2.25; 2 -2.99,1.75; 3 -2.99,1.25; 4 -2.99,0.75; 5 -2.99,0.25; 6 -2.99,-0.25; 7 -2.99,-0.75; 8 -2.99,-1.25; 9 -2.99,-1.75; 10 -2.99,-2.25; 21 2.99,-2.25; 22 2.99,-1.75; 23 2.99,-1.25; 24 2.99,-0.75; 25 2.99,-0.25; 26 2.99,0.25; 27 2.99,0.75; 28 2.99,1.25; 29 2.99,1.75; 30 2.99,2.25 | smd 0.25 x 1: 11 -2.25,-2.99; 12 -1.75,-2.99; 13 -1.25,-2.99; 14 -0.75,-2.99; 15 -0.25,-2.99; 16 0.25,-2.99; 17 0.75,-2.99; 18 1.25,-2.99; 19 1.75,-2.99; 20 2.25,-2.99; 31 2.25,2.99; 32 1.75,2.99; 33 1.25,2.99; 34 0.75,2.99; 35 0.25,2.99; 36 -0.25,2.99; 37 -0.75,2.99; 38 -1.25,2.99; 39 -1.75,2.99; 40 -2.25,2.99 | smd 4 x 4: TP 0,0
W5500 = smd 1.5 x 0.3: 1 -4.45,2.75; 2 -4.45,2.25; 3 -4.45,1.75; 4 -4.45,1.25; 5 -4.45,0.75; 6 -4.45,0.25; 7 -4.45,-0.25; 8 -4.45,-0.75; 9 -4.45,-1.25; 10 -4.45,-1.75; 11 -4.45,-2.25; 12 -4.45,-2.75; 25 4.45,-2.75; 26 4.45,-2.25; 27 4.45,-1.75; 28 4.45,-1.25; 29 4.45,-0.75; 30 4.45,-0.25; 31 4.45,0.25; 32 4.45,0.75; 33 4.45,1.25; 34 4.45,1.75; 35 4.45,2.25; 36 4.45,2.75 | smd 0.3 x 1.5: 13 -2.75,-4.45; 14 -2.25,-4.45; 15 -1.75,-4.45; 16 -1.25,-4.45; 17 -0.75,-4.45; 18 -0.25,-4.45; 19 0.25,-4.45; 20 0.75,-4.45; 21 1.25,-4.45; 22 1.75,-4.45; 23 2.25,-4.45; 24 2.75,-4.45; 37 2.75,4.45; 38 2.25,4.45; 39 1.75,4.45; 40 1.25,4.45; 41 0.75,4.45; 42 0.25,4.45; 43 -0.25,4.45; 44 -0.75,4.45; 45 -1.25,4.45; 46 -1.75,4.45; 47 -2.25,4.45; 48 -2.75,4.45
QFN-16 = smd 0.8 x 0.3: P1 -1.45,0.75; P2 -1.45,0.25; P3 -1.45,-0.25; P4 -1.45,-0.75; P9 1.45,-0.75; P10 1.45,-0.25; P11 1.45,0.25; P12 1.45,0.75 | smd 0.3 x 0.8: P5 -0.75,-1.45; P6 -0.25,-1.45; P7 0.25,-1.45; P8 0.75,-1.45; P13 0.75,1.45; P14 0.25,1.45; P15 -0.25,1.45; P16 -0.75,1.45 | smd 1.7 x 1.7: PAD 0,0
TERMBLOCK_1X2-3.5MM = drill 1 pad 2.184: 1 1.8,0; 2 -1.7,0
HANRUN_POE = drill 0.9 pad 1.3: 1 5.715,-8.89; 2 4.445,-6.35; 3 3.175,-8.89; 4 1.905,-6.35; 5 0.635,-8.89; 6 -0.635,-6.35; 7 -1.905,-8.89; 8 -3.175,-6.35; 9 -4.445,-8.89; 10 -5.715,-6.35 | drill 1 pad 1.422: 11 6.625,4.08; 12 4.085,4.08; 13 -4.085,4.08; 14 -6.625,4.08 | drill 1.6 pad 2.184: M1 7.875,-3.05; M2 -7.875,-3.05 | hole 3.3: -5.715,0; 5.715,0
CRYSTAL_3.2X2.5 = smd 1.4 x 1.2: 1 -1.1,-0.8; 2 1.1,0.8; GND1 -1.1,0.8; GND2 1.1,-0.8
RESONATOR-SMD = smd 0.7 x 1.7: 1 -1.2,0; 2 0,0; 3 1.2,0

### Placement (x,y rotation side)
25MHZ1  32.47,42.75 270 top
C1  36.78,9.28 90 top
C2  36.78,14.47 90 top
C3  33.8,9.28 270 top
C4  33.8,14.47 270 top
C5  35.39,9.28 90 top
C6  35.39,14.47 90 top
C7  38.18,9.28 90 top
C8  38.18,14.47 90 top
C9  39.57,9.28 90 top
C10  39.57,14.47 90 top
C11  27.38,18.03 0 top
C12  28.09,21.18 0 top
C13  21.21,21.15 90 top
C14  35.2,18.28 0 top
C15  39.26,19.17 90 top
C16  19.51,18.41 90 top
C18  26.44,5.82 0 top
C19  29.47,6.35 90 top
C20  26.43,7.49 0 top
C22  23.69,5.91 90 top
C24  32.14,4.06 90 top
C25  27.38,16 0 top
C44  21.16,39.98 270 top
C45  19.39,39.98 90 top
C46  28.25,42.71 270 top
C47  26.75,42.72 270 top
C48  23.91,58.75 180 top
C49  19.26,60.17 270 top
C50  34.91,42.71 270 top
C51  29.94,42.71 270 top
C52  23.92,50.12 180 top
C53  23.92,43.22 180 top
C54  23.94,48.39 180 top
C55  23.91,41.15 0 top
C56  23.91,55.28 180 top
C57  23.91,57.02 180 top
C58  21.12,60.17 270 top
C59  33.51,60.93 0 top
C60  11.14,34.29 90 top
C61  16.54,34.29 180 top
C62  16.54,32.07 180 top
C63  10.19,25.08 0 top
C64  4.79,38.42 0 top
D4  6.38,12.38 180 top
D17  39.72,34.13 180 top
D18  13.3,33.5 90 top
D19  8.81,34.27 90 top
IC1  32.65,33.89 270 top
J1  22.73,30.16 270 top
J2  25.27,30.16 270 top
J3  20.19,30.16 270 top
J4  5.27,7.73 0 top
J19  1.83,29.55 270 top
J20  31.78,25.88 0 top
L1  29.22,2.79 0 top
L2  29.67,17.27 270 top
L3  28.53,10.92 180 top
L4  28.53,13.46 180 top
L7  23.91,60.51 0 top
L8  15.43,27.3 0 top
Q1  9.87,10.84 90 top
R1  35.2,19.77 180 top
R2  37.86,19.17 270 top
R3  41.6,8.38 90 top
R4  41.73,15.12 90 top
R5  45.54,7.49 270 top
R6  45.54,14.22 90 top
R7  22.25,18.35 180 top
R9  19.68,21.78 270 top
R17  14.31,14.86 90 top
R18  24.48,3.17 0 top
R23  10.19,7.94 180 top
R34  28.54,60.58 180 top
R35  23.91,53.56 0 top
R36  23.91,51.85 0 top
R37  23.93,44.94 0 top
R38  23.93,46.67 0 top
R39  17.35,60.13 270 top
R40  17.58,39.98 90 top
R41  38.04,42.76 90 top
R42  10.36,39.08 270 top
R43  11.81,38.44 270 top
R44  36.5,42.76 270 top
R45  39.72,53.8 90 top
R54  38.13,34.13 270 top
R55  14.7,39.24 180 top
SP2  7.65,16.51 0 top
SW2  38.29,23.81 180 top
TP1  31.51,8.65 180 top
TP2  31.51,11.76 180 top
TP3  31.51,14.86 180 top
TP4  41.6,18.54 180 top
TP5  41.6,4.97 180 top
TP6  41.59,11.76 180 top
TP7  31.51,18.29 180 top
U1  21.7,12.46 180 top
U2  32.94,53.02 315 top
U$19  [HEEPLOGO]  56.36,23 0 top
U$55  9.4,29.21 270 top
X2  12.09,3.65 0 top
X3  10.88,50.16 90 top
X4  19.08,3.65 0 top
Y1  24.06,21.15 180 top
Y2  38.5,29.44 270 top

### Tracks (layer width: path | path; a pad name or v marks a point on that pad's centre or on a via)
11  (via drill 0.35)
  Top 0.152: IC1.12 29.81,30.07 29.81,29.19 29.48,28.86 28.4,28.86 v28.11,28.57 | v27.65,26.7 v27.65,25.08 | J4.1 9.13,7.73 R23.2 9.34,9.88 9.7,10.24 9.7,11.43 9.38,11.75 6.88,11.75 6.75,11.89 6.75,13.02 9.17,15.44 9.17,15.51 9.3,15.64 9.65,15.64 v15.6,21.59
  Bottom 0.152: v28.11,28.57 27.97,28.43 27.97,27.3 27.65,26.99 v27.65,26.7 | v27.65,25.08 23.83,21.26 15.93,21.26 v15.6,21.59
13
  Top 0.254: D17.A 38.91,34.37 38.91,34.32 38.74,34.15 37.51,34.15 37.35,34.32 37.35,35.39 36.85,35.89 IC1.32
+3V3  (via drill 0.35)
  Top 0.203: R18.2 25.33,3.9 v24.8,4.43
  Top 0.254: U1.23 18.61,13.81 18.17,13.81 17.93,14.05 v17.93,15.31 | v17.93,15.31 17.93,16.31 19.18,17.57 v19.51,17.57 | U1.40 24.34,9.47 25.43,8.38 25.43,7.64 C20.1 | C49.1 19.1,61.02 | C47.1 v26.76,43.56 | R44.1 R41.2 | U2.28 33.22,50.97 33.22,59.52 v33.05,59.69 33.05,60.54 C59.1 | U$55.P5 7.87,29.89 7.52,29.89 7.27,29.64 7.27,27.45 8.35,26.37 8.35,24.88 9.41,23.81 16.06,23.81 17.17,24.92 17.03,25.07 L8.P$2 17.98,26.35 17.98,25.09 17.93,25.04 v17.93,15.31 | R44.1 36.5,44.43 v36.17,44.77 | R44.1 35.69,42.79 35.69,41.2 35.15,40.66 35.15,37.55 | IC1.34 35.15,37.55 | IC1.33 | IC1.33 36.13,36.58 35.15,37.55 | IC1.44 27.97,37.37 v28.02,37.42 | v28.23,34.36 28.23,34.19 28.19,34.15 | IC1.14 31.15,29.93 v31.38,29.38 | v28.6,30.54 28.32,30.66 27.27,30.66 26.19,31.74 v26.19,34.53 | D4.C 7.65,12.41 SP2.- 11.13,15.89 12.73,15.89 | IC1.24 36.03,31.99 35.61,31.99 35.45,32.15 35.45,36.13 35.61,36.3 36.02,36.3 IC1.33
  Top 0.305: IC1.6 28.45,33.89 28.19,34.15 25.39,36.95 18.73,36.95 v18.6,36.83 | R39.1 17.39,61.02 19.1,61.02 | C49.1 C58.1 22.55,61.02 L7.1
  Top 0.35: 35.91,48.28 U2.28
  Top 0.406: v35.91,47.95 35.91,48.28
  Top 0.813: C61.1 C62.1 17.97,32.07 19.87,30.16 | v26.76,43.56 C46.1 28.88,44.19 28.88,44.34 29.37,44.83 30.28,44.83 30.53,45.09 v30.67,45.09 | 19.87,30.16 J3.1 | L8.P$2 17.97,27.3 J3.3 J3.2 20.19,29.84 19.87,30.16
  Top 1.27: L8.P$2 17.03,25.98 16.71,25.66 16.71,20.28 13.02,16.59 13.02,16.18 12.73,15.89 12.73,5.99 X2.2
  Bottom 0.203: v19.51,17.57 19.66,17.88 R7.2 | v24.8,4.43 24.8,6.71 C20.1
  Bottom 0.254: C20.1 25.45,7.62 20.03,7.62 17.49,10.16 17.49,10.97 | 17.49,10.97 | 17.49,10.97 17.49,11.8 16.84,12.45 16.84,13.56 16.91,13.63 16.91,14.15 17.02,14.26 17.29,14.53 17.29,14.67 v17.93,15.31 | v36.17,44.77 35.32,45.62 35.32,46.1 | v28.02,37.42 28.23,36.57 v28.23,34.36 28.06,34.53 v26.19,34.53 | v31.38,29.38 30.54,30.54 v28.6,30.54 | R40.1 17.58,37.84 v18.6,36.83 | L7.1 23.87,59.69 v33.05,59.69
  Bottom 0.305: v18.6,36.83
  Bottom 0.813: v26.76,43.56 26.72,43.56 23.43,40.26 20.76,40.26 v18.6,36.83 | v30.67,45.09 31.69,46.1 35.32,46.1 35.84,46.62 35.84,47.88 v35.91,47.95 | C61.1 18.6,35.6 v18.6,36.83
  other vias: 25.58,7.49 21.4,18.35 17.29,34.29 17.58,39.13 23.06,60.51
A1  (via drill 0.35)
  Top 0.254: IC1.37 33.65,37.93 33.61,37.98 33.61,38.76 v33.68,38.84
  Bottom 0.254: v33.68,38.84 27.25,38.84 24.7,36.29 24.64,36.23 23.95,35.54 23.95,26.3 J1.3
A2  (via drill 0.35)
  Top 0.254: IC1.38 33.15,38.51 33.07,38.58 33.07,39.09 33.15,39.16 v33.15,39.44
  Bottom 0.254: v33.15,39.44 32.94,39.24 27.08,39.24 23.49,35.65 23.49,34.09 21.86,32.46 21.86,31.02 21.51,30.67 21.51,29.66 22.73,28.44 J1.2 22.41,27.62
A3  (via drill 0.35)
  Top 0.254: v21.67,34.82 22.57,33.92 J1.1 | v32.29,39.86 32.29,38.59 32.65,38.23 IC1.39
  Bottom 0.254: v21.67,34.82 26.71,39.86 v32.29,39.86
ACTLED  (via drill 0.35)
  Top 0.254: U2.27 34.28,49.21 33.68,49.21 31.14,46.67 v29.24,46.67
  Bottom 0.254: v29.24,46.67 20.21,46.67 20.18,46.7 19.68,46.7 17.84,48.55 15.35,48.55 9.64,54.25 X3.12
D7  (via drill 0.35)
  Top 0.254: IC1.1 28.76,36.81 27.77,36.81 26.13,38.45 v22.89,38.45
  Bottom 0.254: v22.89,38.45 15.23,30.79 15.27,23.5 14,22.23 14,21.27 14.16,21.11 14.16,15.86 R17.2
  other vias: 14.31,15.71
D+1
  Top 0.254: IC1.4 29.08,34.98 27.97,34.98 25.52,37.43 12.94,37.43 12.59,37.78 12.59,38.26 11.81,39.03 R43.1
D-1
  Top 0.254: IC1.3 28.14,35.39 25.69,37.84 13.8,37.84 13.02,38.62 13.02,39.52 12.42,40.12 11.19,40.12 11,39.92 R42.1
EN1  (via drill 0.35)
  Top 0.254: IC1.31 36.22,35.3 36.64,35.3 36.94,34.99 36.94,34.15 37.01,34.09 v37.01,33.8 | v37.49,37.78 35.76,39.52 v35.76,40.32
  Bottom 0.254: v37.01,33.8 37.01,37.29 v37.49,37.78 | v35.76,40.32 32.69,40.32 32.55,40.46 25.89,40.46 15.9,30.48 15.9,22.75 14.99,21.84 14.99,21.34 15.9,20.43 15.9,8.57 17.17,7.3 17.17,3.86 X4.2
GND  (via drill 0.35, 0.4, 0.5)
  Top 0.152: C13.2 21.4,22
  Top 0.203: U1.1 25.16,10.21 25.76,9.62 | v36.27,18.03 36.59,18 C14.2 | U1.3 25.17,11.21 26.05,10.34 v26.05,9.4 | v33.6,32.94 IC1.THERMAL 31.14,35.4 v31.14,35.56
  Top 0.254: C8.1 v38.18,11.81 C7.2 | C10.1 v39.57,11.81 | C9.2 v39.57,11.81 | v41.61,11.81 41.65,11.81 TP6.P$1 v41.59,11.81 v39.57,11.81 | C4.1 33.8,16.26 v33.68,16.38 | TP2.P$1 33.5,11.76 v33.68,11.94 | C11.2 C25.2 27.22,14.99 27.22,14.56 25.87,13.21 U1.7 22.45,13.21 U1.TP 20.45,13.71 U1.18 | 25.76,9.62 25.83,9.62 v26.05,9.4 27.38,8.07 C20.2 | U1.11 23.95,16.19 v24.52,16.76 | U$55.P4 8.65,29.96 v8.92,29.69 | R34.1 31.37,60.58 v31.46,60.48 | IC1.5 32.15,34.39 IC1.THERMAL | IC1.43 30.75,37.27 30.75,36.85 32.65,34.95 IC1.THERMAL | IC1.35 34.65,35.89 IC1.THERMAL | IC1.23 35.15,31.39 v33.6,32.94 | IC1.15 31.74,30.51 31.74,30.93 32.65,31.84 IC1.THERMAL | U2.29 34.32,50.59 v34.32,52.39 | R54.1 38.13,36.83 v39.72,38.42 | C13.2 20.57,22.63 R9.1
  Top 0.305: v9.87,28.73 10.1,28.96 U$55.P14 U$55.P15 | U$55.PAD 10.6,29.21 U$55.P15 | U$55.P15 10.1,29.46 v9.87,29.69
  Top 0.356: R5.2 v45.54,13.08 R6.1
  Top 0.406: R6.1 45.54,14.86
  Bottom 0.254: v33.68,16.38 33.68,16.32 | v33.68,11.94 33.94,11.94 | 31.62,60.33 v31.46,60.48 31.65,60.3 33.3,60.3 34.22,59.37 v35.27,59.37 | C44.2 21.23,39.12 21.3,39.05 | v34.32,52.39 32.41,52.39 v32.1,52.07
  Bottom 0.406: v45.54,13.08 45.54,11.94
  other vias: 39.38,21.97 39.38,6.1 34.24,4.13 37.03,11.94 36.02,11.94 37.99,4.96 35.51,2.6 29.44,22.87 39.13,23.37 29.1,9.14 31.83,1.4 33.16,22.1 33.92,6.41 30.94,22.03 32.07,22.87 34.88,22.86 36.02,21.97 25.88,4.53 37.54,22.16 35.91,5.33 28.94,21.18 19.68,22.63 8.92,28.73 21.16,39.13 19.39,40.83 15.79,34.29 19.26,59.32 19.51,19.27 38.5,29.44
  pour Bottom (isolate 0.254): 40.35,14.48 46.45,14.48 46.45,9.14 40.35,9.14
  pour Top (rank 2): -15.53,64.01 -15.53,-4.57 40.35,-4.57 40.35,64.01
  pour Bottom (rank 2): -17.43,65.41 -17.43,-2.54 40.35,-2.54 40.35,65.41
INT  (via drill 0.35)
  Top 0.254: v39.73,51.45 38.4,51.45 U2.36 | v38.46,40.31 38.04,40.73 R41.1
  Bottom 0.254: v39.73,51.45 40.39,50.8 40.39,48.27 40.24,48.13 40.24,47.12 40.27,47.1 40.27,42.11 v38.46,40.31
IRQ  (via drill 0.35)
  Top 0.152: v17.57,13.25 17.57,13.15 17.97,12.76 18.67,12.76 U1.25 | v35.32,29.21 35.07,29.46 35.07,29.51 34.65,29.93 IC1.21 | v27.65,20.19 29.55,20.19 30.68,21.31 34.36,21.31 35.56,22.51 35.56,23.61 35.76,23.81 v37.81,23.81
  Bottom 0.152: v17.57,13.25 20.97,16.65 20.97,17.38 21.3,17.7 21.58,17.7 23.87,19.99 24.58,19.99 24.77,20.19 v27.65,20.19 | v35.32,29.21 35.32,28.23 37.81,25.74 v37.81,23.81
LNKLED  (via drill 0.35)
  Top 0.254: v34.95,46.99 34.15,47.8 U2.25
  Bottom 0.254: 34.75,46.79 v34.95,46.99 30.41,46.99 29.49,46.07 21.96,46.07 19.37,43.47 16.57,43.47 16.27,43.77 | 16.25,43.76 16.27,43.77 | X3.14 7.1,43.54 10.04,46.48 13.56,46.48 16.27,43.77
MISO  (via drill 0.35)
  Top 0.152: v29.25,29.42 27.26,29.42 27.05,29.21 27.05,28.92 v27.31,28.67 | v27.05,27.33 27.05,24.74 27.33,24.45 29.08,24.45 J20.1
  Top 0.254: IC1.11 27.65,31.39 v27.52,31.26 | U2.34 38.53,49.91 38.59,49.91 39.66,48.84 v39.66,48.49
  Bottom 0.152: v27.31,28.67 27.31,27.59 v27.05,27.33
  Bottom 0.254: v39.66,48.49 39.66,42.36 37.67,40.37 37.67,39.1 30.37,31.8 28.06,31.8 v27.52,31.26 28,30.79 28,30.29 28.35,29.93 28.58,29.93 v29.25,29.42
MOSI  (via drill 0.35)
  Top 0.254: IC1.10 27.2,31.89 v27.08,32.01 | U2.35 37.71,51.47 38.83,50.34 v39.78,50.34 | v30.63,28.57 31.74,27.15 J20.4
  Bottom 0.254: v39.78,50.34 39.05,49.62 39.05,42.33 37.27,40.54 37.27,39.27 30.2,32.21 27.29,32.21 v27.08,32.01 27.08,31.68 26.91,31.52 26.91,30.74 29.08,28.57 v30.63,28.57
MOSI/SDA/TX  (via drill 0.35)
  Top 0.152: v16.88,11.22 U1.28 | IC1.19 33.65,29.33 v33.71,29.28
  Bottom 0.152: 16.94,11.27 v16.88,11.22 16.33,11.77 16.33,13.56 16.55,13.78 16.55,14.3 16.94,14.68 16.94,16.5 19.15,18.71 19.74,18.71 21.33,20.3 | v33.71,29.28 32.95,27.56 32.95,26.66 32.53,26.24 32.53,25.51 32.95,25.09 32.95,22.92 31.48,21.45 29.45,21.45 29.17,21.73 25.89,21.73 24.45,20.3 21.33,20.3 | 21.35,20.32 21.33,20.3
N$1
  Top 0.203: U1.4 25.26,11.71 26.05,10.92 L3.2
N$2
  Top 0.254: U1.6 26.93,12.71 L4.2
N$3
  Top 0.203: C1.2 C5.2 | 32.06,9.19 31.51,9.19 31.51,9.27
  Top 0.254: L3.1 29.38,10.64 29.47,10.55
  Top 0.406: TP1.P$1 32.06,8.7 32.06,9.19 33.16,10.29 34.22,10.29 C3.1 C1.2 | 29.16,10.86 29.47,10.55 30.62,9.4 31.38,9.4 31.51,9.27
N$4
  Top 0.356: TP5.P$1 42.49,4.08 42.49,3.94 44.27,2.16 86.43,2.16 88.46,4.19 88.46,50.3 87.45,51.32 87.45,58.05 86.43,59.06 44.27,59.06 43.51,58.3 43.51,11.94 44.53,10.92 44.53,5.46 45.8,4.19 85.41,4.19 86.43,5.21 86.43,50.3 85.41,51.32 85.41,56.27 84.65,57.03 46.05,57.03 45.54,56.52 R6.2
  Top 0.406: TP5.P$1 41.6,7.42 R3.1
N$5  (via drill 0.4, 0.5)
  Top 0.356: v88.46,51.82 88.46,58.55 86.94,60.08 43.77,60.08 42.49,58.8 42.49,19.43 TP4.P$1 | v87.45,49.79 87.45,4.7 85.92,3.17 45.04,3.17 43.51,4.7 v43.51,10.54 | v44.53,12.32 44.53,57.54 45.04,58.05 85.67,58.05 86.43,57.28 v86.43,51.82 | v85.41,49.79 85.41,5.97 84.65,5.21 46.31,5.21 45.54,5.97 R5.1 45.54,7.87
  Top 0.406: R4.2 41.73,18.42 TP4.P$1
  Bottom 0.406: v87.45,49.79 v88.46,51.82 | v43.51,10.54 v44.53,12.32 | v86.43,51.82 v85.41,49.79
N$7
  Top 0.203: U1.14 22.57,15.57 22.57,15.99 24.16,17.57 24.16,21.27 24.83,21.95 Y1.1
  Top 0.254: Y1.1 25.2,21.91 26.51,21.91 C12.1
N$8
  Top 0.152: 22.91,20.3 22.91,19.54 22.33,18.95 22.33,16.8 22.21,16.68
  Top 0.203: U1.15 21.95,16.42 22.21,16.68 | Y1.2 22.91,20.3 C13.1
N$9
  Top 0.152: C15.1 37.86,19.72 R2.1
N$10  (via drill 0.35, 0.4)
  Top 0.203: 34.18,18.29 C14.1 33.68,17.47 v33.25,17.47 | v33.27,19.77 R1.2 | U1.9 25.43,14.21 v26.12,14.9
  Bottom 0.203: v33.27,19.77 33.25,19.66 v33.25,17.47 30.68,14.9 v26.12,14.9
N$11
  Top 0.203: 36.09,19.74 R1.1 37.23,20.95 | 36.09,19.74 36.21,19.68 | 35.78,19.74 36.09,19.74 | 33.05,20.95 37.23,20.95 | 37.23,20.95 38.45,20.95 39.26,20.14 C15.2
  Top 0.254: U1.10 24.69,14.82 25.72,15.84 25.72,18.65 26.65,19.58 29.45,19.58 30.83,20.95 33.05,20.95
N$12  (via drill 0.35)
  Top 0.203: TP3.P$1 TP7.P$1
  Top 0.406: C2.1 C6.1 C4.2 33.74,13.46 32.92,13.46 31.52,14.86 TP3.P$1 31,14.35 30.75,14.35 29.86,13.46 L4.1
  Bottom 0.152: R2.2 37.86,17.41 36.74,16.29 36.74,13.67 C2.1
  other vias: 36.78,13.62 37.86,18.32
N$13
  Top 0.254: U1.8 25.79,13.71 26.81,14.73 26.81,15.49 27.32,16 C25.1 C11.1 26.53,18.71 27,19.17 29.04,19.17 29.67,18.54 L2.1
N$14  (via drill 0.4)
  Top 0.203: v27.83,4.45 28.88,5.5 C19.1 | v27.32,12.13 27.23,12.21 U1.5
  Top 0.254: 27.83,4.57 v27.83,4.45 27.83,3.24 L1.1
  Bottom 0.305: v27.32,12.13 27.32,5.08 27.83,4.57 v27.83,4.45
N$15
  Top 0.254: R17.1 14.31,4.06 X2.1
N$29
  Top 0.203: R23.1 11.04,9.99 Q1.1
N$30
  Top 0.254: SP2.+ 5.11,14.85 D4.A 6.66,10.84 Q1.3
N$37
  Top 0.254: C44.1 22.23,41.89 22.23,42.08 22.59,42.44 23.73,42.44 23.94,42.64 23.94,49.03 24.12,49.21 26.11,49.21 26.4,48.92 26.6,48.92 26.74,48.78 29.76,48.78 U2.20
N$38
  Top 0.254: C45.1 20.25,40 21.78,40 22.15,40.37 23.73,40.37 23.89,40.53 23.89,42.03 25.03,42.03 25.97,42.97 25.97,44.24 27.97,46.24 27.97,46.99 28.31,47.34 28.86,47.34 29.02,47.5 29.9,47.5 U2.22
N$39
  Top 0.254: U2.10 26.7,56.79 26.7,60.01 27.27,60.58 R34.2
N$40  (via drill 0.35)
  Top 0.254: R38.1 R37.1
  Bottom 0.254: R37.1 23.08,41.48 C55.1
  other vias: 23.08,44.94 23.06,41.15
N$41
  Top 0.254: C50.1 35.3,43.95 | U2.31 36.27,50.02 36.93,49.36 36.93,47.53 34.91,45.51 C50.1 | 25MHZ1.3 33.68,41.91 33.68,42.55 34.7,43.56 C50.1
N$42
  Top 0.254: C51.1 30.3,43.92 31.46,43.92 | 31.46,43.92 25MHZ1.1 | U2.30 36.42,49.19 36.52,49.19 36.52,47.7 35.21,46.38 31.81,46.38 31.46,46.04 31.46,43.92
N$43
  Top 0.203: IC1.16 32.15,29.9 31.96,29.71 31.96,28.47 32.1,28.34 32.27,28.34 32.86,27.75 33.24,27.75 33.82,28.34 34.81,28.34 34.92,28.23 Y2.3
N$44
  Top 0.203: IC1.17 32.65,30.03 32.53,29.91 32.53,29.77 32.32,29.56 32.32,28.7 32.42,28.7 32.95,28.16 33.14,28.16 33.68,28.7 34.96,28.7 35.07,28.59 36.22,28.59 37.18,29.54 37.18,30.16 37.65,30.64 Y2.1
N$45  (via drill 0.35)
  Top 0.254: v6.54,29.84 6.25,29.55 J19.3
  Bottom 0.254: 8.73,35.12 8.75,35.14 | 8.75,35.14 R43.2 | v6.54,29.84 6.54,30.98 7.18,31.62 7.18,33.58 8.75,35.14
  other vias: 11.81,37.59
N$46  (via drill 0.35)
  Top 0.254: J19.2 4.83,30.37 5.65,30.37 6.33,31.05 6.33,31.63 v6.57,31.87
  Bottom 0.254: v6.57,31.87 6.57,34.44 R42.2
  other vias: 10.36,38.23
N$51
  Top 0.254: R54.2 39.52,33.28 D17.C
N$52  (via drill 0.35)
  Top 0.254: X3.13 8.85,44.03 8.85,43.61 10.04,42.42 11.44,42.42 13.05,40.81 14.55,40.81 14.56,40.83 R40.2
  other vias: 17.58,40.83
N$53  (via drill 0.35)
  Bottom 0.254: R39.2 14.78,59.28 14.55,59.52 9.53,59.52 X3.11
  other vias: 17.35,59.28
N$54
  Top 0.254: 9.15,27.21 U$55.P10 9.15,26.96 9.11,26.92 9.11,25.42 C63.1
N$55
  Top 0.203: U1.37 22.45,8.67 22.24,8.47 22.24,7.46 22.95,6.76 22.96,6.76 C22.2
N$56
  Top 0.254: U$55.P13 U$55.P12 10.51,27.4 10.51,26.51 10.94,26.08 C63.2
  Top 0.305: D18.C 11.14,31.65 U$55.P1 U$55.P16 13.09,29.96 13.84,29.21 13.83,29.2 L8.P$1 12,27.3 U$55.P13
N$57  (via drill 0.35)
  Top 0.813: R55.1 15.45,39.55 v15.59,39.69 | v18.76,42.55 19.77,43.56 X3.9
  Bottom 0.813: v15.59,39.69 16.7,40.8 16.7,41.19 18.05,42.55 v18.76,42.55
NSS/SCL/RX  (via drill 0.35)
  Top 0.152: U1.27 18.56,11.86 18.18,11.86 16.94,13.11 v16.94,17.28 | IC1.18 33.15,29.46 v32.9,29.21
  Bottom 0.152: v32.9,29.21 32,28.32 31.3,28.32 30.41,27.43 30.41,26.29 30.75,25.95 30.75,25.49 30.41,25.15 30.41,23.02 29.68,22.29 25.98,22.29 24.65,20.95 18.53,20.95 16.94,19.36 v16.94,17.28
RD+
  Top 0.254: C53.2 21.3,44.98 21.3,54.61 20.03,55.88 X3.1
RD-
  Top 0.254: C54.2 22.95,48.26 22.25,48.26 21.94,48.58 21.94,55.88 20.95,56.86 19.37,56.86 18.79,56.29 18.79,56.23 17.23,54.67 X3.2
RDN  (via drill 0.35)
  Top 0.254: R38.2 C54.1 | C54.1 24.97,48.58 | U2.5 30.33,56.73 29.76,57.29 29.76,57.7 v29.41,58.05 | v25.78,50.84 25.78,50.97 26.4,51.58 26.4,53.67 v26.7,53.98 | C54.1 25.56,48.4 v25.75,48.58
  Bottom 0.254: v26.7,53.98 26.7,57.15 27.36,57.81 28.86,57.81 29.09,58.05 v29.41,58.05 | v25.75,48.58 25.78,48.61 v25.78,50.84
RDP  (via drill 0.35)
  Top 0.254: C53.1 R37.2 26.48,46.63 v26.48,48.16 | U2.6 29.87,56.35 29.31,56.91 28.53,56.91 v28.29,57.15 | v26.7,50.16 26.7,51.31 26.81,51.41 26.81,53.02 27.35,53.56 v27.43,53.56
  Bottom 0.254: v28.29,57.15 27.43,56.29 v27.43,53.56 | v26.48,48.16 26.48,49.94 v26.7,50.16
RST
  Top 0.152: IC1.13 30.65,29.57 30.07,28.99 30.07,28.34 30.61,27.8 30.61,26.66 31.3,25.98 32.95,25.98 J20.5 SW2.2
  Top 0.254: SW2.4 SW2.2 | IC1.13 30.66,30.41
RSTPD_N  (via drill 0.35)
  Top 0.152: U1.38 22.95,9.03 22.89,8.97 22.89,8.29 v22.82,8.23 | R18.1 21.45,5.35 v21.45,8.23 | IC1.20 34.15,29.64 v34.51,29.28
  Bottom 0.152: v21.45,8.23 v22.82,8.23 22.82,10.89 22.92,10.99 22.92,13.06 25.72,15.86 27.32,15.86 32.98,21.52 34.35,21.52 35.49,22.65 35.49,27.63 34.51,28.6 v34.51,29.28
SCK  (via drill 0.35)
  Top 0.254: v26.93,33.83 26.97,33.79 26.97,32.97 27.55,32.39 IC1.9 | v38.34,49.31 36.97,50.67 U2.33 | v28.47,25.85 28.5,25.82 29.74,25.82 30.96,24.61 J20.3
  Bottom 0.152: v28.47,25.85 28.18,26.14 27.32,26.14 26.49,26.97 26.49,28.63
  Bottom 0.254: v38.34,49.31 38.34,42.44 36.86,40.96 36.86,39.44 30.04,32.62 27.33,32.62 26.97,32.97 26.97,33.79 v26.93,33.83 26.93,32.71 26.47,32.26 26.47,30.68 26.49,30.67 26.49,28.63
SCSN_WIZ  (via drill 0.35)
  Top 0.254: IC1.8 27.91,32.89 v27.58,33.22 | U2.32 37.42,49.6 v37.42,44.94
  Bottom 0.254: v27.58,33.22 30.07,33.22 36.45,39.61 36.45,41.13 36.5,41.18 R44.2 37.42,42.83 v37.42,44.94
  other vias: 36.5,41.91
SEL0  (via drill 0.35)
  Top 0.203: U1.16 21.45,17.06 v21.53,17.14
  Bottom 0.203: v21.53,17.14 21.62,17.23
  Bottom 0.254: 21.62,17.23 22.74,18.35 R7.1
  other vias: 23.1,18.35
SEL1
  Top 0.254: U1.17 20.95,16.87 20.67,17.15 20.43,17.39 20.35,17.47 20.35,20.64 20.05,20.93 R9.2
TDN  (via drill 0.35)
  Top 0.254: R36.1 v23.05,51.84 | U2.1 31.67,58.11 30.44,59.34 29.85,59.34 28.92,58.42 v28.6,58.42 | v26.06,54.61 25.79,54.34 v25.79,51.84
  Bottom 0.254: 25.83,51.84 v25.79,51.84 v23.05,51.84 22.2,51.84 20.18,49.82 17.52,49.82 X3.6 | v26.06,54.61 26.06,57.78 26.7,58.42 v28.6,58.42
TDP  (via drill 0.35)
  Top 0.254: v30.19,58.74 30.41,58.74 U2.2
  Bottom 0.254: v30.19,58.74 29.87,59.05 25.75,59.05 23.06,56.37 R35.1 20.3,50.8 X3.5
  other vias: 23.06,53.56
TX1_ANTENNA
  Top 0.203: C9.1 C7.1 C1.1 C5.1
  Top 0.406: C9.1 39.62,8.73 40.22,8.73 40.82,9.33 41.6,9.33 R3.2
TX2_ANTENNA
  Top 0.203: C10.2 C8.2 C2.2 C6.2
  Top 0.406: C10.2 39.98,15.42 41.07,14.33 41.56,14.33 R4.1
VBAT  (via drill 0.35)
  Top 0.305: U$55.P11 9.69,27.71 9.69,27.32 9.71,27.3 v9.71,26.67 | 9.15,31.16 U$55.P3 U$55.P2 | 9.15,31.16 9.15,31.43 | 9.15,31.43 9.15,31.59 | 9.15,31.59 9.15,31.91 | 9.15,31.91 9.15,32.23 | 9.15,32.23 9.15,33.04 D19.C 9.44,32.75 | U$55.P2 9.65,31.11 | 9.65,31.11 9.65,31.68 | 9.65,31.68 9.65,31.91 | 9.65,31.91 9.65,32.23 | 9.65,32.23 9.65,32.54 9.44,32.75 | U$55.P2 9.15,31.16 | 9.65,31.11 9.46,31.11 9.27,31.31 | 9.27,31.31 9.15,31.43 | 9.27,31.31 9.65,31.68 | 9.15,31.59 9.46,31.91 9.65,31.91 | 9.15,31.91 9.46,32.23 9.65,32.23 | 9.15,32.23 9.44,32.52 9.44,32.75 | R55.2 13.85,40.21 13.68,40.38 12.87,40.38 11.26,41.99 10.82,41.99 7.45,38.61 C64.+
  Top 0.406: 10.76,33.16 C60.1
  Top 0.813: C60.1 v11.14,33.34
  Top 1.016: D19.C 11.1,33.38 v11.14,33.34
  Bottom 0.305: v9.71,26.67 8.44,26.67 7.17,27.94 7.17,30.79 D19.C
  Bottom 0.813: R55.2 13.85,36.05 v11.14,33.34
  other vias: 8.81,32.42 13.85,39.24
VBUS
  Top 0.254: IC1.7 29.27,33.3 29.69,33.3 29.85,33.13 29.85,31.04 29.21,30.39 29.21,30.29 28.76,29.84 27.02,29.84 26.7,29.53 26.7,28.42 27.18,27.94 28.92,27.94 29.24,27.62 J20.2
  Top 0.305: 8.27,36.54 8.65,36.25 | 8.65,36.25 D19.A 9.04,36.36 14.13,36.36 14.29,36.19 18.86,36.19 19.17,36.49 25.2,36.49 28.26,33.43 29.13,33.43 IC1.7 | J19.1 4.95,31.14 5.72,31.14 5.9,31.32 5.9,32.09 8.65,34.84 8.65,36.25
VCC  (via drill 0.35)
  Top 0.152: L1.2 29.99,2.73 29.76,2.5
  Top 0.203: 23.45,8.58 23.45,8.53 24.69,7.29 24.69,6.72 C18.1 26.99,4.42 26.99,2.57 27.66,1.91 28.1,1.91
  Top 0.254: 23.45,8.58 v23.45,8.74 U1.39 | v29.56,15.56 29.67,15.67 L2.2 | 28.1,1.91 29.16,1.91 29.76,2.5 30.16,2.9 | L1.2 31.72,2.79 C24.1
  Bottom 0.254: v29.56,15.56 29.51,15.51 25.87,15.51 25.52,15.15 25.52,10.81 v23.45,8.74
VCCA  (via drill 0.35)
  Top 0.254: C56.1 R35.2 R36.2 C52.1 25.24,49.65 26.19,49.65 26.51,49.53 v27.65,49.53 27.97,49.84 28.37,49.84 | C56.1 C57.1 | C57.1 | C57.1 C48.1 L7.2 | C56.1 27.5,55.28 U2.11 28.31,54.58 28.87,54.02 29.1,54.02 29.83,54.74 | 29.83,54.74 29.83,54.88 29.87,54.93 29.83,54.97 29.83,54.98 29.27,55.54 U2.8 | U2.4 30.68,56.95 31.24,56.39 31.24,56.16 29.83,54.74 | U2.15 28.56,51.01 28,50.45 28,50.22 28.37,49.84 | 28.37,49.84 28.6,49.84 29.17,50.41 U2.17 | U2.21 29.63,47.94 v28.6,47.94
  Bottom 0.254: v28.6,47.94 28.6,48.58 v27.65,49.53
WIZ_RST  (via drill 0.35)
  Top 0.203: IC1.22 35.74,31.01 36.63,31.01 37.37,31.75 v38.13,31.75
  Top 0.254: v38.45,39.37 40.39,41.31 40.39,51.66 39.72,52.33 R45.1 39.31,52.95 U2.37
  Bottom 0.254: v38.45,39.37 38.13,39.05 v38.13,31.75

### Text on the board
tPlace: 24V Passive PoE / 13.56MHz RFID | FUSE | A3-A1 | 3v3 | GND | 13 | RST | PIEZO | 11 | ~ | NEO | 7 | 5 | DOTSTAR | 3 | V | GND
bPlace: 24V / Pre-Fuse | GND
tNames: RX | TX2 | L4 | L3 | TX1 | L3 | TX1 | C5 | C1 | C7 | C9 | C3